# Altium project BreadBoard_project.PrjPcb (part 1 of 2)
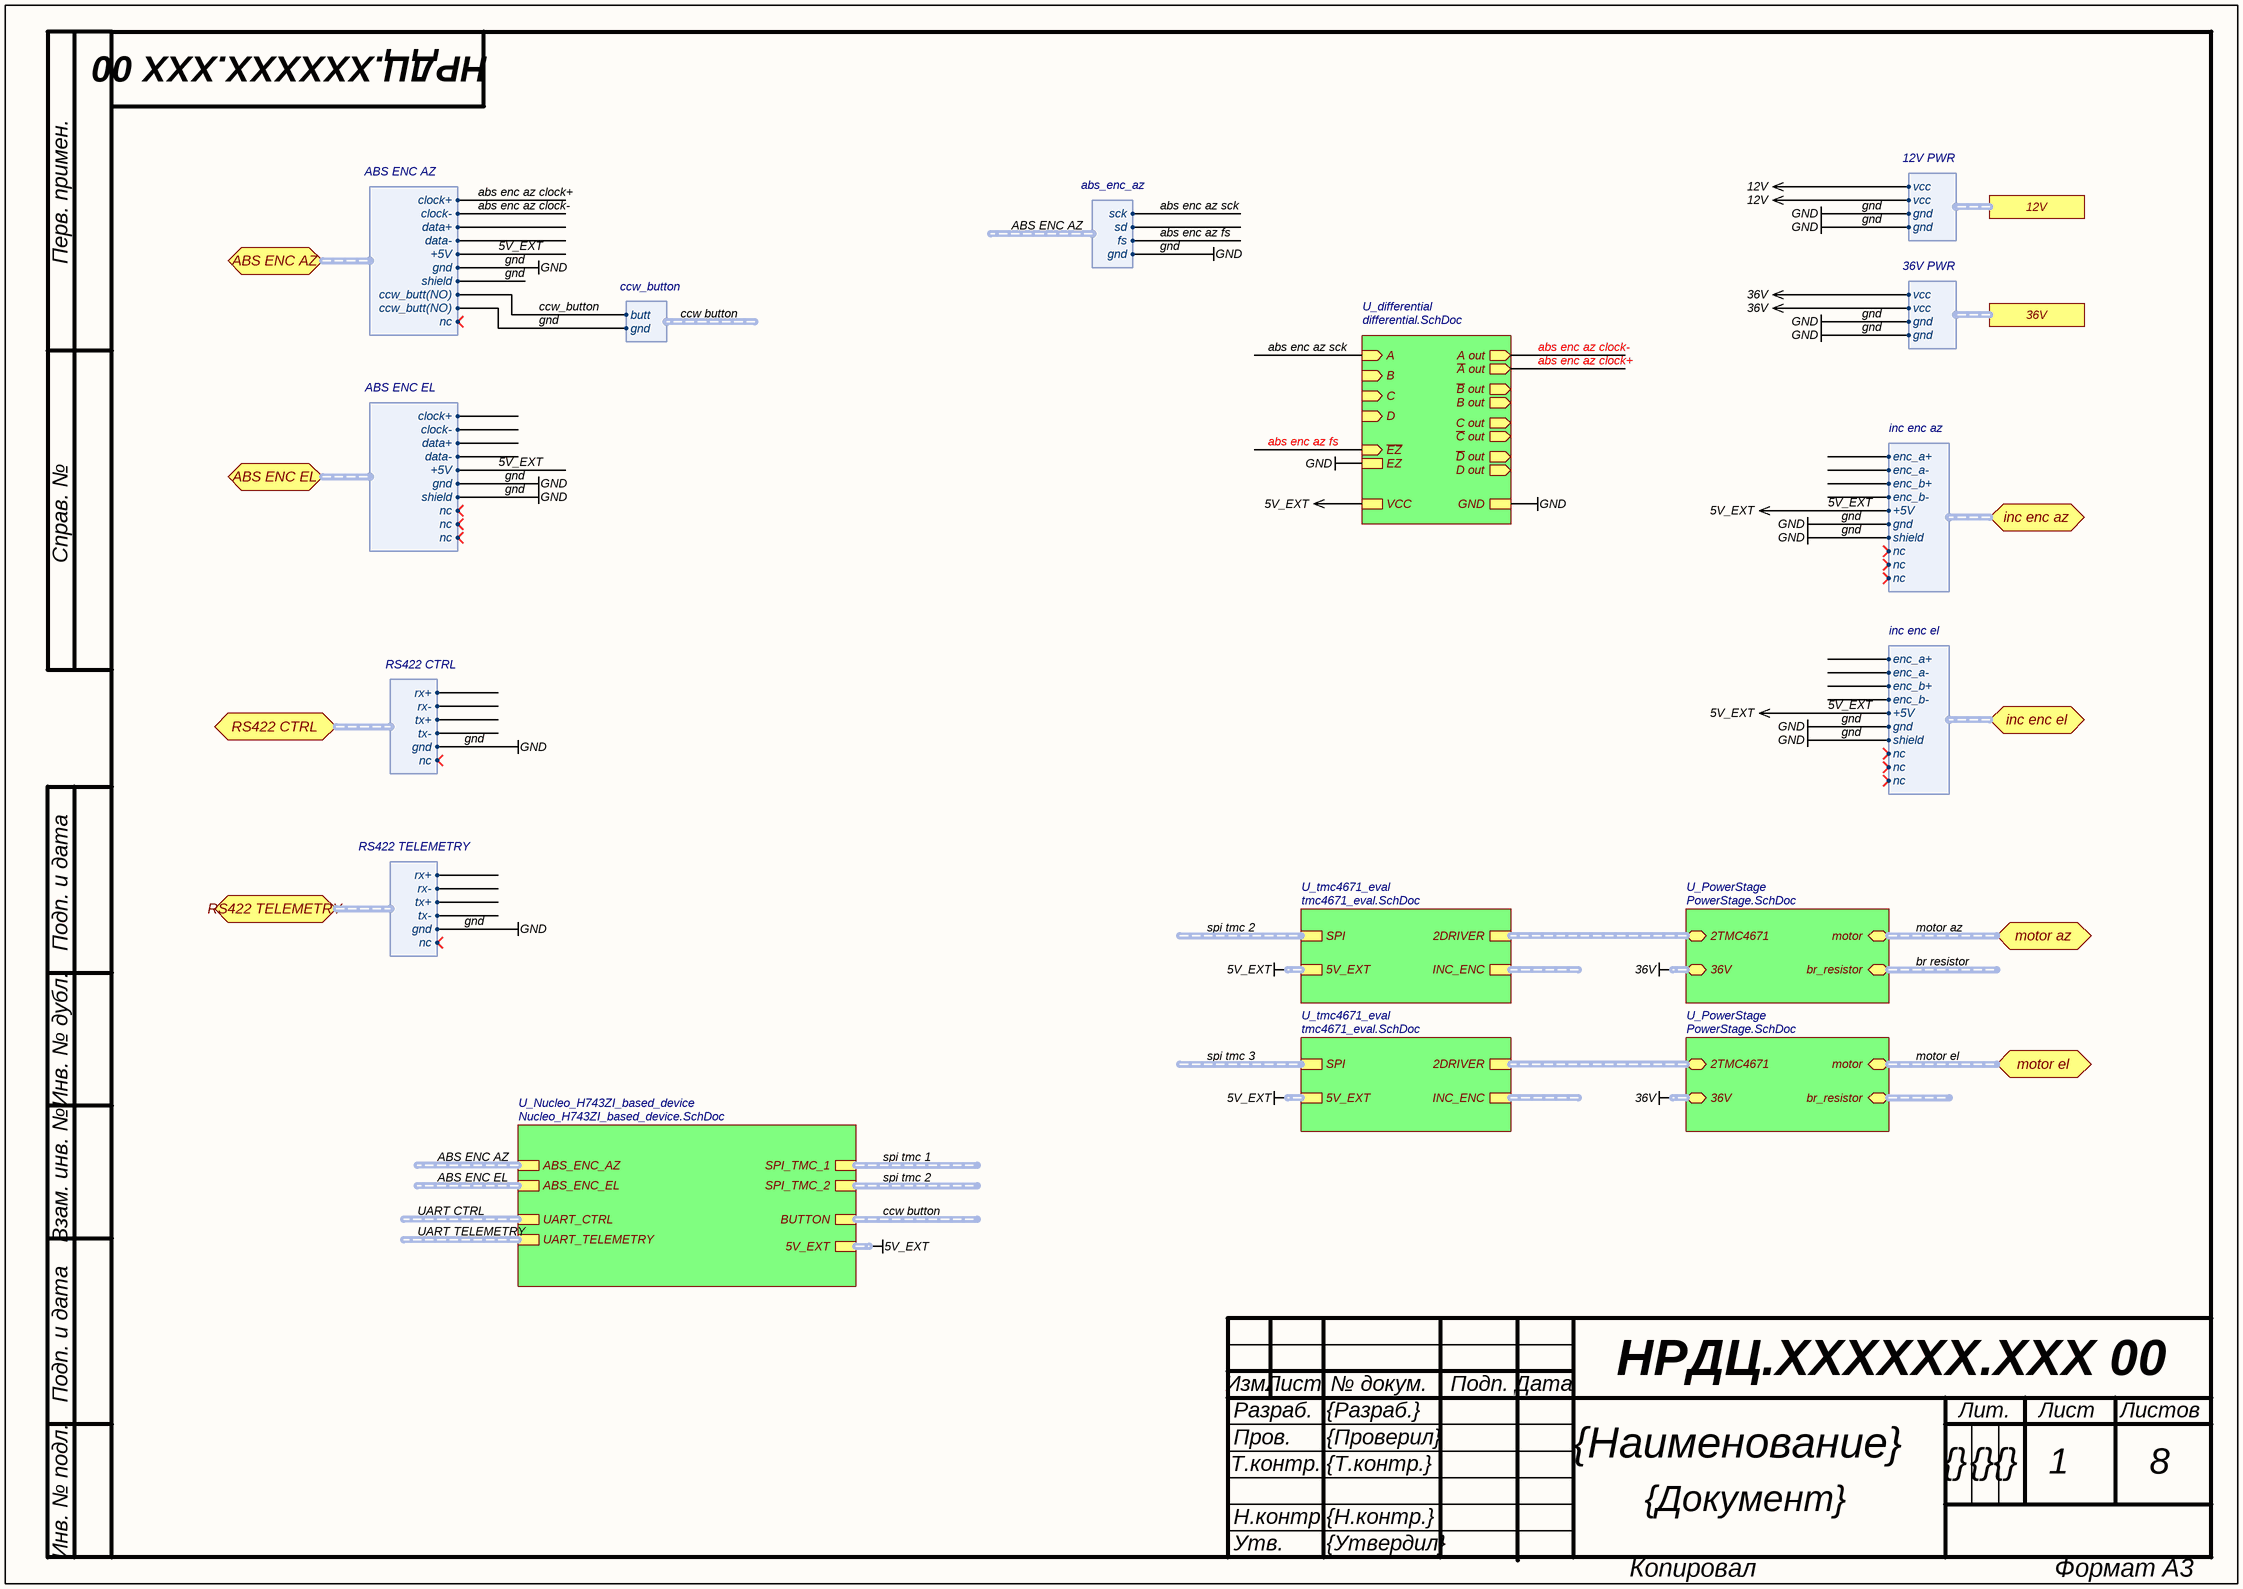
[diagram p0: Top.SchDoc]
8 sheets, 219 parts. Net scope: hierarchical (ports join the sheet entries above them; power ports are global).
Sheets:
  Top.SchDoc
    U_Nucleo_H743ZI_based_device = Nucleo_H743ZI_based_device.SchDoc
      U_Nucleo_H743ZI = Nucleo_H743ZI.SchDoc
    U_tmc4671_eval = tmc4671_eval.SchDoc
      U_tmc4671_InterfaceConnectors = tmc4671_InterfaceConnectors.SchDoc
      U_tmc4671_Output_Feedback = tmc4671_Output_Feedback.SchDoc
    U_tmc4671_eval = tmc4671_eval.SchDoc
      U_tmc4671_InterfaceConnectors = tmc4671_InterfaceConnectors.SchDoc
      U_tmc4671_Output_Feedback = tmc4671_Output_Feedback.SchDoc
    U_PowerStage = PowerStage.SchDoc
    U_PowerStage = PowerStage.SchDoc
    U_differential = differential.SchDoc

## Sheet Top.SchDoc: {Наименование}
size 420 x 297 mm; ApprovedBy: {Утвердил}; CheckedBy: {Проверил}; DrawnBy: {Разраб.}; DocumentNumber: НРДЦ.ХХХХХХ.ХХХ 00; SheetNumber: 1; SheetTotal: 8; Scale: {Мш.}; PageSetup: Record=PageOptions|CenterHorizontal=False|CenterVertical=False|PrintScale=0.95|XCorrection=0.00|YCorrection=0.00|PrintKind=1|BorderSize=5000000|LeftOffset=0|BottomOffset=0|Orientation=1|PaperLength=1000|PaperWidth=1000|Scale=100|PaperSource=15|PrintQuality=600|MediaType=1|DitherType=10|PaperKind=A4|PrintScaleMode=1; ProcessInspection: {Т.контр.}; Mass: {М.}; NormInspection: {Н.контр.}; Letter1Column: {}; Letter2Column: {}; Letter3Column: {}; DocumentType: {Документ}; Rule: PcbType=ProtelPcb

### Sub-sheets
U_differential = differential.SchDoc: A (in), A out (out), ~{A} out (out), ~{EZ} (in), ~{B} out (out), B out (out), B (in), GND, C (in), C out (out), ~{C} out (out), ~{D} out (out), D out (out), D (in), VCC, EZ
U_Nucleo_H743ZI_based_device = Nucleo_H743ZI_based_device.SchDoc: ABS_ENC_AZ (harness abs_enc_az), SPI_TMC_1 (harness spi_tmc_1), SPI_TMC_2 (harness spi_tmc_2), ABS_ENC_EL (harness abs_enc_el), UART_TELEMETRY (harness uart_telemetry), UART_CTRL (harness uart_ctrl), BUTTON (harness ccw_button), 5V_EXT (harness 5V_ext)
U_PowerStage = PowerStage.SchDoc: motor (bidir), br_resistor (bidir), 2TMC4671 (bidir), 36V (bidir)
U_PowerStage = PowerStage.SchDoc: motor (bidir), br_resistor (bidir), 2TMC4671 (bidir), 36V (bidir)
U_tmc4671_eval = tmc4671_eval.SchDoc: SPI (harness tmc_spi), 5V_EXT (harness 5V_tmc), 2DRIVER (harness tmc_spi), INC_ENC (harness tmc_inc_enc)
U_tmc4671_eval = tmc4671_eval.SchDoc: SPI (harness tmc_spi), 5V_EXT (harness 5V_tmc), 2DRIVER (harness tmc_spi), INC_ENC (harness tmc_inc_enc)

### Ports
12V (harness 12V PWR), 36V (harness 36V PWR), ABS ENC AZ (bidir, harness ABS ENC AZ), ABS ENC EL (bidir, harness ABS ENC EL), inc enc az (bidir, harness inc enc az), inc enc el (bidir, harness inc enc el), motor az (bidir), motor el (bidir), RS422 CTRL (bidir, harness RS422 CTRL), RS422 TELEMETRY (bidir, harness RS422 TELEMETRY)

### Harnesses
inc enc az: enc_a+, enc_a-, enc_b+, enc_b-, +5V, gnd, shield, nc, nc, nc
inc enc el: enc_a+, enc_a-, enc_b+, enc_b-, +5V, gnd, shield, nc, nc, nc
ABS ENC AZ: clock+, clock-, data+, data-, +5V, gnd, shield, ccw_butt(NO), ccw_butt(NO), nc
ABS ENC EL: clock+, clock-, data+, data-, +5V, gnd, shield, nc, nc, nc
ccw_button: butt, gnd
RS422 CTRL: rx+, rx-, tx+, tx-, gnd, nc
RS422 TELEMETRY: rx+, rx-, tx+, tx-, gnd, nc
12V PWR: vcc, gnd, vcc, gnd
36V PWR: vcc, gnd, vcc, gnd
abs_enc_az: sck, sd, fs, gnd

### Nets
5V_EXT: sheet U_differential/VCC, port inc enc az.+5V, port inc enc el.+5V, port ABS ENC AZ.+5V, port ABS ENC EL.+5V
12V: port 12V.vcc
36V: port 36V.vcc
abs enc az fs: sheet U_differential/~{EZ}, sheet U_Nucleo_H743ZI_based_device/ABS_ENC_AZ.fs
abs enc az sck: sheet U_differential/A, sheet U_Nucleo_H743ZI_based_device/ABS_ENC_AZ.sck
ccw_button: sheet U_differential/GND, sheet U_differential/EZ, port inc enc az.gnd, port inc enc az.shield, port inc enc el.gnd, port inc enc el.shield, port ABS ENC AZ.gnd, port ABS ENC AZ.shield, port ABS ENC AZ.ccw_butt(NO), port ABS ENC EL.gnd, port ABS ENC EL.shield, sheet U_Nucleo_H743ZI_based_device/BUTTON.butt, sheet U_Nucleo_H743ZI_based_device/BUTTON.gnd, port RS422 CTRL.gnd, port RS422 TELEMETRY.gnd, port 12V.gnd, port 36V.gnd, sheet U_Nucleo_H743ZI_based_device/ABS_ENC_AZ.gnd  [also labelled GND]  [project net ABS ENC AZ.gnd]
abs enc az clock+: sheet U_differential/~{A} out, port ABS ENC AZ.clock+
abs enc az clock-: sheet U_differential/A out, port ABS ENC AZ.clock-

### Buses and harness runs
harness ABS ENC AZ = sheet U_Nucleo_H743ZI_based_device/ABS_ENC_AZ
harness ABS ENC EL = sheet U_Nucleo_H743ZI_based_device/ABS_ENC_EL
harness br resistor = sheet U_PowerStage/br_resistor
harness ccw button = sheet U_Nucleo_H743ZI_based_device/BUTTON
harness motor az = port motor az = sheet U_PowerStage/motor
harness motor el = port motor el = sheet U_PowerStage/motor
harness sheet U_PowerStage/2TMC4671 = sheet U_tmc4671_eval/2DRIVER
harness spi tmc 1 = sheet U_Nucleo_H743ZI_based_device/SPI_TMC_1
harness spi tmc 2 = sheet U_Nucleo_H743ZI_based_device/SPI_TMC_2
harness spi tmc 2 = sheet U_tmc4671_eval/SPI
harness spi tmc 3 = sheet U_tmc4671_eval/SPI
harness UART CTRL = sheet U_Nucleo_H743ZI_based_device/UART_CTRL
harness UART TELEMETRY = sheet U_Nucleo_H743ZI_based_device/UART_TELEMETRY

### Notes on the sheet
- Labels drawn without touching a wire or pin: 5V_EXT, 36V
- Перв. примен.
- Справ. №
- Подп. и дата
- Инв. № дубл.
- Взам. инв. №
- Изм.
- Лист
- № докум.
- Подп.
- Дата
- Т.контр.
- Пров.
- Разраб.
- Лит.
- Листов
- Инв. № подл.
- Н.контр.
- Утв.
- Копировал
- Формат А3

## Sheet Nucleo_H743ZI_based_device.SchDoc: {Наименование}
size 420 x 297 mm; DocumentNumber: НРДЦ.ХХХХХХ.ХХХ ХХ; SheetNumber: 2; SheetTotal: 8; PageSetup: Record=PageOptions|CenterHorizontal=False|CenterVertical=False|PrintScale=0.95|XCorrection=0.00|YCorrection=0.00|PrintKind=1|BorderSize=5000000|LeftOffset=0|BottomOffset=0|Orientation=1|PaperLength=1000|PaperWidth=1000|Scale=100|PaperSource=15|PrintQuality=600|MediaType=1|DitherType=10|PaperKind=A4|PrintScaleMode=1; Rule: PcbType=ProtelPcb
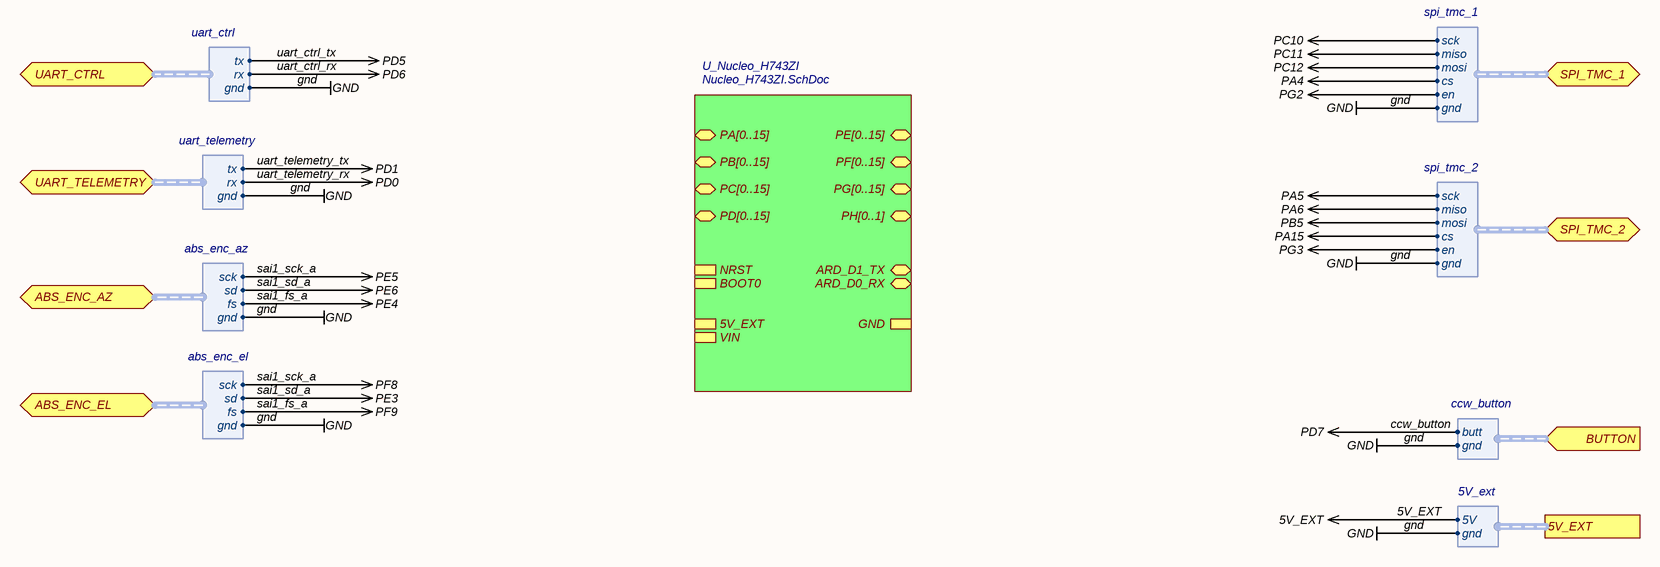
[diagram p1: Nucleo_H743ZI_based_device.SchDoc]

### Sub-sheets
U_Nucleo_H743ZI = Nucleo_H743ZI.SchDoc: PF[0..15] (bidir), PG[0..15] (bidir), PE[0..15] (bidir), PD[0..15] (bidir), ARD_D1_TX (bidir), PH[0..1] (bidir), PA[0..15] (bidir), ARD_D0_RX (bidir), BOOT0, PB[0..15] (bidir), PC[0..15] (bidir), NRST, 5V_EXT, VIN, GND

### Ports
5V_EXT (harness 5V_ext), ABS_ENC_AZ (bidir, harness abs_enc_az), ABS_ENC_EL (bidir, harness abs_enc_el), BUTTON (in, harness ccw_button), SPI_TMC_1 (bidir, harness spi_tmc_1), SPI_TMC_2 (bidir, harness spi_tmc_2), UART_CTRL (bidir, harness uart_ctrl), UART_TELEMETRY (bidir, harness uart_telemetry)

### Harnesses
abs_enc_az: sck, sd, fs, gnd
uart_ctrl: tx, rx, gnd
uart_telemetry: tx, rx, gnd
abs_enc_el: sck, sd, fs, gnd
ccw_button: butt, gnd
5V_ext: 5V, gnd
spi_tmc_1: sck, miso, gnd, mosi, en, cs
spi_tmc_2: sck, miso, gnd, mosi, en, cs

### Nets
5V_EXT: sheet U_Nucleo_H743ZI/5V_EXT, port 5V_EXT.5V
ccw_button: sheet U_Nucleo_H743ZI/GND, port ABS_ENC_AZ.gnd, port UART_CTRL.gnd, port UART_TELEMETRY.gnd, port ABS_ENC_EL.gnd, port BUTTON.butt, port BUTTON.gnd, port 5V_EXT.gnd, port SPI_TMC_1.gnd, port SPI_TMC_2.gnd  [also labelled GND, PD7]  [project net ABS ENC AZ.gnd]
PA4: port SPI_TMC_1.cs  [project net spi tmc 1.cs]
PC10: port SPI_TMC_1.sck  [project net spi tmc 1.sck]
PC11: port SPI_TMC_1.miso  [project net spi tmc 1.miso]
PC12: port SPI_TMC_1.mosi  [project net spi tmc 1.mosi]
PD0: port UART_TELEMETRY.rx  [also labelled uart_telemetry_rx]  [project net UART TELEMETRY.rx]
PD1: port UART_TELEMETRY.tx  [also labelled uart_telemetry_tx]  [project net UART TELEMETRY.tx]
PD5: port UART_CTRL.tx  [also labelled uart_ctrl_tx]  [project net UART CTRL.tx]
PD6: port UART_CTRL.rx  [also labelled uart_ctrl_rx]  [project net UART CTRL.rx]
PE3: port ABS_ENC_AZ.sd, port ABS_ENC_EL.sd  [also labelled PE6, sai1_sd_a]  [project net ABS ENC AZ.sd]
PE4: port ABS_ENC_AZ.fs, port ABS_ENC_EL.fs  [also labelled PF9, sai1_fs_a]  [project net abs enc az fs]
PE5: port ABS_ENC_AZ.sck, port ABS_ENC_EL.sck  [also labelled PF8, sai1_sck_a]  [project net abs enc az sck]
PG2: port SPI_TMC_1.en  [project net spi tmc 1.en]

### Notes on the sheet
- Подп. и дата
- Инв. № дубл.
- Взам. инв. №
- Инв. № подл.
- Лист
- Изм.
- № докум.
- Подп.
- Дата
- Копировал
- Формат А3

## Sheet Nucleo_H743ZI.SchDoc: {Наименование}
size 420 x 297 mm; DocumentNumber: НРДЦ.ХХХХХХ.ХХХ ХХ; SheetNumber: 3; SheetTotal: 3; PageSetup: Record=PageOptions|CenterHorizontal=False|CenterVertical=False|PrintScale=0.95|XCorrection=0.00|YCorrection=0.00|PrintKind=1|BorderSize=5000000|LeftOffset=0|BottomOffset=0|Orientation=1|PaperLength=1000|PaperWidth=1000|Scale=100|PaperSource=15|PrintQuality=600|MediaType=1|DitherType=10|PaperKind=A4|PrintScaleMode=1; Rule: PcbType=ProtelPcb
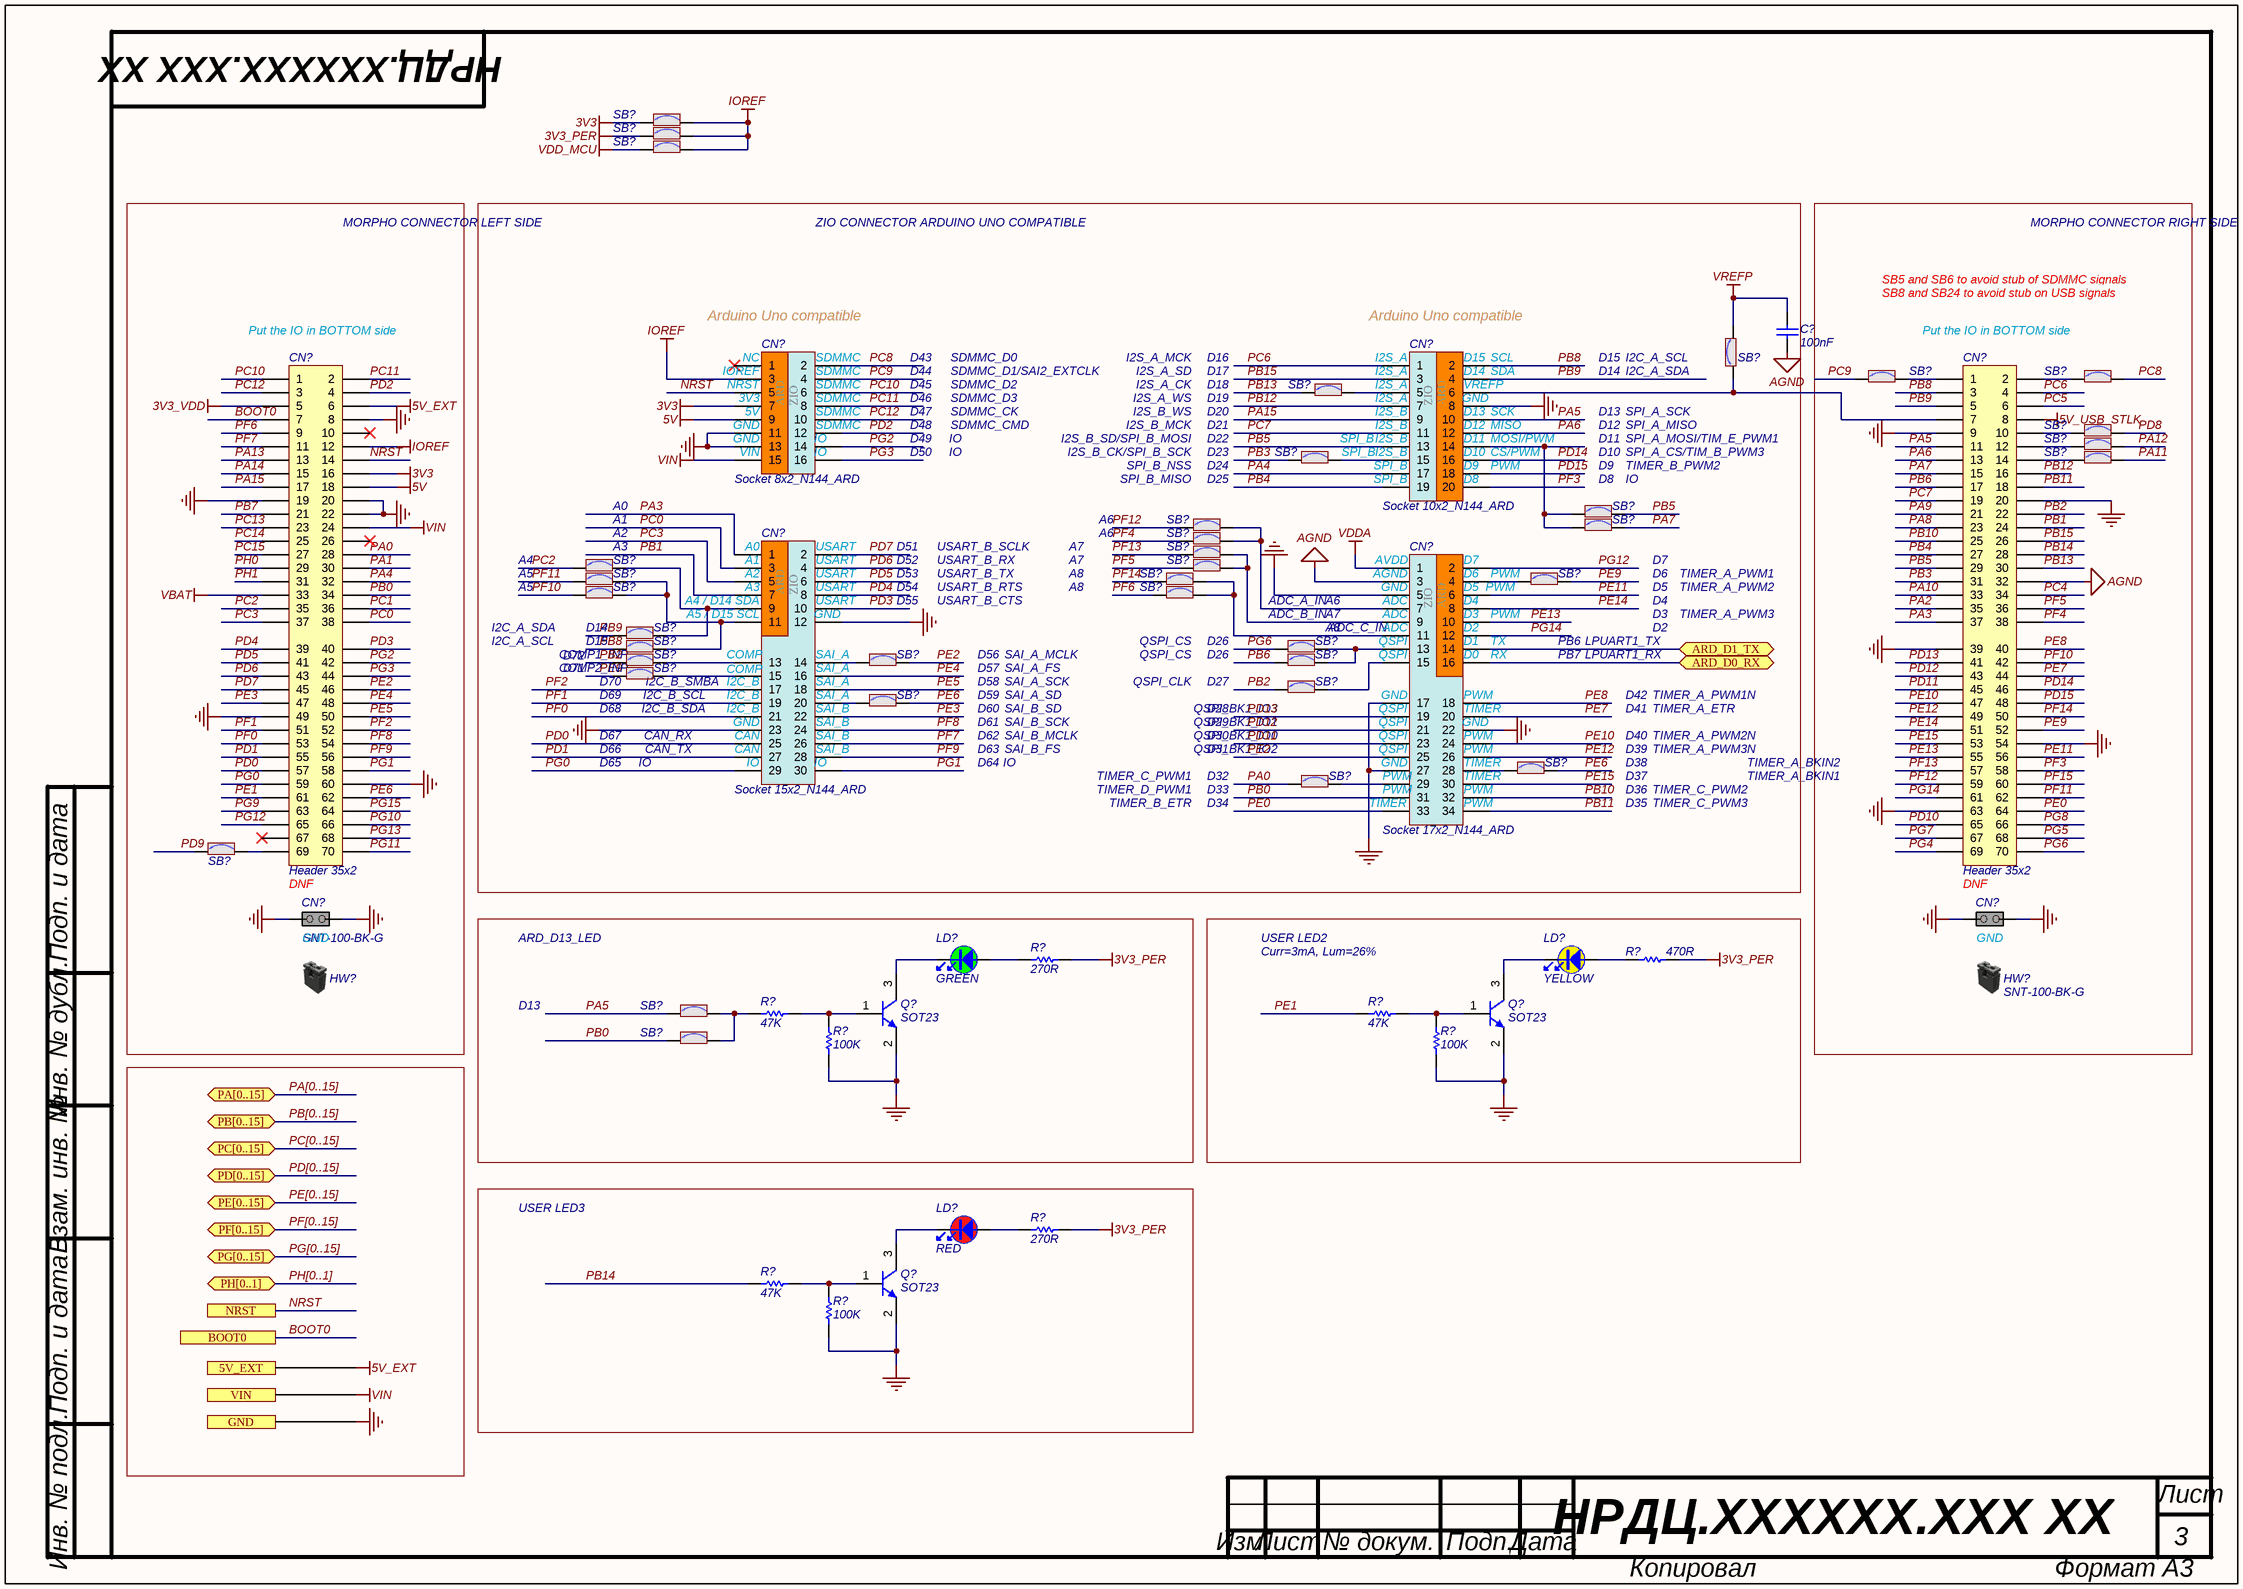
[diagram p2: Nucleo_H743ZI.SchDoc]

### Parts
(Parts that share a designator on the sheet are numbered #1, #2 ... from top to bottom, then left to right.)
C?  value 100nF  [C0603]  (hidden comment: Capacitor)
CN?#1  Socket 8x2_N144_ARD  [CON_SAMTEC_SSW-108-23-X-D_N144_ARD]
CN?#2  Socket 10x2_N144_ARD  [CON_SAMTEC_SSW-110-23-X-D_N144_ARD]
CN?#3  Header 35x2  [CON_SAMTEC_TSW-135-07-X-D]
CN?#4  Header 35x2  [CON_SAMTEC_TSW-135-07-X-D]
CN?#5  Socket 15x2_N144_ARD  [CON_SAMTEC_SSW-115-23-X-D_N144_ARD]
CN?#6  Socket 17x2_N144_ARD  [CON_SAMTEC_SSW-117-23-X-D_N144_ARD]
CN?#7  Jumper_Header 2x1  [CON_SAMTEC_TSW-102-09-X-S]  (value not drawn)
CN?#8  Jumper_Header 2x1  [CON_SAMTEC_TSW-102-09-X-S]  (value not drawn)
HW?#1  value SNT-100-BK-G  (hidden comment: Shunt Black 2.54mm)  (mechanical)
HW?#2  value SNT-100-BK-G  (hidden comment: Shunt Black 2.54mm)  (mechanical)
LD?#1  value GREEN  [LED_0603_OSRAM_LG-Q396-PS-35_GREEN_1A2K_H0P4]  (hidden comment: LED_green)
LD?#2  value YELLOW  [LED_0603_OSRAM_LY-Q396-P1Q2-36_YELLOW_1A2K_H0P4]  (hidden comment: LED_yellow)
LD?#3  value RED  [LED_0603_OSRAM_LS-Q976-NR-1_RED_1A2K_H0P8]  (hidden comment: LED_red)
Q?#1  value SOT23  [NPN_SOT23]  (hidden comment: 9013-SOT23)
Q?#2  value SOT23  [NPN_SOT23]  (hidden comment: 9013-SOT23)
Q?#3  value SOT23  [NPN_SOT23]  (hidden comment: 9013-SOT23)
R?#1  value 270R  [R0402]  (hidden comment: Resistor)
R?#2  value 470R  [R0402]  (hidden comment: Resistor)
R?#3  value 47K  [R0603]  (hidden comment: Resistor)
R?#4  value 47K  [R0603]  (hidden comment: Resistor)
R?#5  value 100K  [R0603]  (hidden comment: Resistor)
R?#6  value 100K  [R0603]  (hidden comment: Resistor)
R?#7  value 270R  [R0402]  (hidden comment: Resistor)
R?#8  value 47K  [R0603]  (hidden comment: Resistor)
R?#9  value 100K  [R0603]  (hidden comment: Resistor)
SB?#1  SB_ON  [SOLDER-BRIDGE_R0603-0R]  (value not drawn)
SB?#2  SB_ON  [SOLDER-BRIDGE_R0603-0R]  (value not drawn)
SB?#3  SB_ON  [SOLDER-BRIDGE_R0603-0R]  (value not drawn)
SB?#4  SB_ON  [SOLDER-BRIDGE_R0603-0R]  (value not drawn)
SB?#5  SB_ON  [SOLDER-BRIDGE_R0603-0R]  (value not drawn)
SB?#6  SB_ON  [SOLDER-BRIDGE_R0603-0R]  (value not drawn)
SB?#7  SB_ON  [SOLDER-BRIDGE_R0603-0R]  (value not drawn)
SB?#8  SB_ON  [SOLDER-BRIDGE_R0402-0R]  (value not drawn)
SB?#9  SB_ON  [SOLDER-BRIDGE_R0603-0R]  (value not drawn)
SB?#10  SB_ON  [SOLDER-BRIDGE_R0603-0R]  (value not drawn)
SB?#11  SB_ON  [SOLDER-BRIDGE_R0603-0R]  (value not drawn)
SB?#12  SB_ON  [SOLDER-BRIDGE_R0603-0R]  (value not drawn)
SB?#13  SB_ON  [SOLDER-BRIDGE_R0402-0R]  (value not drawn)
SB?#14  SB_ON  [SOLDER-BRIDGE_R0603-0R]  (value not drawn)
SB?#15  SB_ON  [SOLDER-BRIDGE_R0402-0R]  (value not drawn)
SB?#16  SB_ON  [SOLDER-BRIDGE_R0402-0R]  (value not drawn)
SB?#17  SB_ON  [SOLDER-BRIDGE_R0402-0R]  (value not drawn)
SB?#18  SB_ON  [SOLDER-BRIDGE_R0402-0R]  (value not drawn)
SB?#19  SB_ON  [SOLDER-BRIDGE_R0402-0R]  (value not drawn)
SB?#20  SB_ON  [SOLDER-BRIDGE_R0402-0R]  (value not drawn)
SB?#21  SB_ON  [SOLDER-BRIDGE_R0402-0R]  (value not drawn)
SB?#22  SB_ON  [SOLDER-BRIDGE_R0402-0R]  (value not drawn)
SB?#23  SB_ON  [SOLDER-BRIDGE_R0402-0R]  (value not drawn)
SB?#24  SB_ON  [SOLDER-BRIDGE_R0402-0R]  (value not drawn)
SB?#25  SB_ON  [SOLDER-BRIDGE_R0402-0R]  (value not drawn)
SB?#26  SB_ON  [SOLDER-BRIDGE_R0402-0R]  (value not drawn)
SB?#27  SB_ON  [SOLDER-BRIDGE_R0402-0R]  (value not drawn)
SB?#28  SB_ON  [SOLDER-BRIDGE_R0402-0R]  (value not drawn)
SB?#29  SB_ON  [SOLDER-BRIDGE_R0402-0R]  (value not drawn)
SB?#30  SB_ON  [SOLDER-BRIDGE_R0402-0R]  (value not drawn)
SB?#31  SB_ON  [SOLDER-BRIDGE_R0402-0R]  (value not drawn)
SB?#32  SB_ON  [SOLDER-BRIDGE_R0402-0R]  (value not drawn)
SB?#33  SB_ON  [SOLDER-BRIDGE_R0402-0R]  (value not drawn)
SB?#34  SB_ON  [SOLDER-BRIDGE_R0402-0R]  (value not drawn)
SB?#35  SB_ON  [SOLDER-BRIDGE_R0402-0R]  (value not drawn)
SB?#36  SB_ON  [SOLDER-BRIDGE_R0603-0R]  (value not drawn)
SB?#37  SB_ON  [SOLDER-BRIDGE_R0603-0R]  (value not drawn)

### Blocks framed on the sheet
USER LED3: LD?#3 Q?#3 R?#7-R?#9

### Ports
5V_EXT, ARD_D0_RX (bidir), ARD_D1_TX (bidir), BOOT0, GND, NRST, PA[0..15] (bidir), PB[0..15] (bidir), PC[0..15] (bidir), PD[0..15] (bidir), PE[0..15] (bidir), PF[0..15] (bidir), PG[0..15] (bidir), PH[0..1] (bidir), VIN

### Nets
3V3: CN?#1.7 CN?#3.16 SB?#1.1
3V3_PER: R?#1.2 R?#2.2 R?#7.2 SB?#2.1
3V3_VDD: CN?#3.5
5V: CN?#1.9 CN?#3.18
5V_EXT: CN?#3.6 ; port 5V_EXT
5V_USB_STLK: CN?#4.8
AGND: C?.1 CN?#4.32 CN?#6.3
GND: CN?#1.11 CN?#1.13 CN?#2.8 CN?#3.8 CN?#3.19 CN?#3.20 CN?#3.22 CN?#3.49 CN?#3.60 CN?#4.9 CN?#4.20 CN?#4.39 CN?#4.54 CN?#4.63 CN?#5.12 CN?#5.23 CN?#6.5 CN?#6.17 CN?#6.22 CN?#6.27 CN?#7.1(COMMON) CN?#7.2(NO) CN?#8.1(COMMON) CN?#8.2(NO) Q?#1.2(E) Q?#2.2(E) Q?#3.2(E) R?#5.1 R?#6.1 R?#9.1 ; port GND  [project net ABS ENC AZ.gnd]
IOREF: CN?#1.3 CN?#3.12 SB?#1.2 SB?#2.2 SB?#3.2
VBAT: CN?#3.33
VDD_MCU: SB?#3.1
VDDA: CN?#6.1
VIN: CN?#1.15 CN?#3.24 ; port VIN
VREFP: C?.2 SB?#4.2
BOOT0: CN?#3.7 ; port BOOT0
NRST: CN?#1.5 CN?#3.14 ; port NRST
PA0: CN?#3.28 SB?#34.1
PA1: CN?#3.30
PA2: CN?#4.35
PA3: CN?#4.37 CN?#5.1
PA4: CN?#2.17 CN?#3.32
PA5: CN?#2.10 CN?#4.11 SB?#36.1
PA6: CN?#2.12 CN?#4.13
PA7: CN?#4.15 SB?#14.2
PA8: CN?#4.23
PA9: CN?#4.21
PA10: CN?#4.33
PA11: SB?#11.2
PA12: SB?#9.2
PA13: CN?#3.13
PA14: CN?#3.15
PA15: CN?#2.9 CN?#3.17
PB0: CN?#3.34 CN?#6.31 SB?#37.1
PB1: CN?#4.24 CN?#5.7
PB2: CN?#4.22 SB?#27.1 SB?#31.1
PB3: CN?#4.31 SB?#10.1
PB4: CN?#2.19 CN?#4.27
PB5: CN?#2.13 CN?#4.29 SB?#12.2
PB6: CN?#4.17 SB?#29.1
PB7: CN?#3.21
PB8: CN?#2.2 CN?#4.3 SB?#25.1
PB9: CN?#2.4 CN?#4.5 SB?#24.1
PB10: CN?#4.25 CN?#6.32
PB11: CN?#4.18 CN?#6.34
PB12: CN?#2.7 CN?#4.16
PB13: CN?#4.30 SB?#7.1
PB14: CN?#4.28 R?#8.1
PB15: CN?#2.3 CN?#4.26
PC0: CN?#3.38 CN?#5.3
PC1: CN?#3.36
PC2: CN?#3.35 SB?#17.1
PC3: CN?#3.37 CN?#5.5
PC4: CN?#4.34
PC5: CN?#4.6
PC6: CN?#2.1 CN?#4.4
PC7: CN?#2.11 CN?#4.19
PC8: CN?#1.2 SB?#6.2
PC9: CN?#1.4 SB?#5.1
PC10: CN?#1.6 CN?#3.1
PC11: CN?#1.8 CN?#3.2
PC12: CN?#1.10 CN?#3.3
PC13: CN?#3.23
PC14: CN?#3.25
PC15: CN?#3.27
PD0: CN?#3.57 CN?#5.25
PD1: CN?#3.55 CN?#5.27
PD2: CN?#1.12 CN?#3.4
PD3: CN?#3.40 CN?#5.10
PD4: CN?#3.39 CN?#5.8
PD5: CN?#3.41 CN?#5.6
PD6: CN?#3.43 CN?#5.4
PD7: CN?#3.45 CN?#5.2
PD8: SB?#8.2
PD9: SB?#35.1
PD10: CN?#4.65
PD11: CN?#4.45 CN?#6.23
PD12: CN?#4.43 CN?#6.21
PD13: CN?#4.41 CN?#6.19
PD14: CN?#2.16 CN?#4.46
PD15: CN?#2.18 CN?#4.48
PE0: CN?#4.64 CN?#6.33
PE1: CN?#3.61 R?#4.1
PE2: CN?#3.46 CN?#6.25 SB?#28.2
PE3: CN?#3.47 CN?#5.22
PE4: CN?#3.48 CN?#5.16
PE5: CN?#3.50 CN?#5.18
PE6: CN?#3.62 SB?#32.2 SB?#33.2
PE7: CN?#4.44 CN?#6.20
PE8: CN?#4.40 CN?#6.18
PE9: CN?#4.52 SB?#21.2 SB?#30.1
PE10: CN?#4.47 CN?#6.24
PE11: CN?#4.56 CN?#6.6
PE12: CN?#4.49 CN?#6.26
PE13: CN?#4.55 CN?#6.10
PE14: CN?#4.51 CN?#6.8
PE15: CN?#4.53 CN?#6.30
PF0: CN?#3.53 CN?#5.21
PF1: CN?#3.51 CN?#5.19
PF2: CN?#3.52 CN?#5.17
PF3: CN?#2.20 CN?#4.58
PF4: CN?#4.38 SB?#15.1
PF5: CN?#4.36 SB?#18.1
PF6: CN?#3.9 SB?#23.1
PF7: CN?#3.11 CN?#5.26
PF8: CN?#3.54 CN?#5.24
PF9: CN?#3.56 CN?#5.28
PF10: CN?#4.42 SB?#22.1
PF11: CN?#4.62 SB?#19.1
PF12: CN?#4.59 SB?#13.1
PF13: CN?#4.57 SB?#16.1
PF14: CN?#4.50 SB?#20.1
PF15: CN?#4.60
PG0: CN?#3.59 CN?#5.29
PG1: CN?#3.58 CN?#5.30
PG2: CN?#1.14 CN?#3.42
PG3: CN?#1.16 CN?#3.44
PG4: CN?#4.69
PG5: CN?#4.68
PG6: CN?#4.70 SB?#26.1
PG7: CN?#4.67
PG8: CN?#4.66
PG9: CN?#3.63
PG10: CN?#3.66
PG11: CN?#3.70
PG12: CN?#3.65 CN?#6.2
PG13: CN?#3.68
PG14: CN?#4.61 CN?#6.12
PG15: CN?#3.64
PH0: CN?#3.29
PH1: CN?#3.31
NetCN?#2_5: CN?#2.5 SB?#7.2
NetCN?#2_6: CN?#2.6 CN?#4.7 SB?#4.1
NetCN?#2_14: CN?#2.14 SB?#12.1 SB?#14.1
NetCN?#2_15: CN?#2.15 SB?#10.2
NetCN?#3_69: CN?#3.69 SB?#35.2
NetCN?#4_1: CN?#4.1 SB?#5.2
NetCN?#4_2: CN?#4.2 SB?#6.1
NetCN?#4_10: CN?#4.10 SB?#8.1
NetCN?#4_12: CN?#4.12 SB?#9.1
NetCN?#4_14: CN?#4.14 SB?#11.1
NetCN?#5_9: CN?#5.9 SB?#17.2 SB?#24.2
NetCN?#5_11: CN?#5.11 SB?#19.2 SB?#22.2 SB?#25.2
NetCN?#5_13: CN?#5.13 SB?#27.2
NetCN?#5_14: CN?#5.14 SB?#28.1
NetCN?#5_15: CN?#5.15 SB?#30.2
NetCN?#5_20: CN?#5.20 SB?#32.1
NetCN?#6_4: CN?#6.4 SB?#21.1
NetCN?#6_7: CN?#6.7 SB?#13.2 SB?#15.2
NetCN?#6_9: CN?#6.9 SB?#16.2 SB?#18.2
NetCN?#6_11: CN?#6.11 SB?#20.2 SB?#23.2
NetCN?#6_13: CN?#6.13 SB?#26.2 SB?#29.2
NetCN?#6_14: CN?#6.14 ; port ARD_D1_TX
NetCN?#6_15: CN?#6.15 SB?#31.2
NetCN?#6_16: CN?#6.16 ; port ARD_D0_RX
NetCN?#6_28: CN?#6.28 SB?#33.1
NetCN?#6_29: CN?#6.29 SB?#34.2
NetLD?#1_1: LD?#1.1 R?#1.1
NetLD?#1_2: LD?#1.2 Q?#1.3(C)
NetLD?#2_1: LD?#2.1 R?#2.1
NetLD?#2_2: LD?#2.2 Q?#2.3(C)
NetLD?#3_1: LD?#3.1 R?#7.1
NetLD?#3_2: LD?#3.2 Q?#3.3(C)
NetQ?#1_1: Q?#1.1(B) R?#3.2 R?#5.2
NetQ?#2_1: Q?#2.1(B) R?#4.2 R?#6.2
NetQ?#3_1: Q?#3.1(B) R?#8.2 R?#9.2
NetR?#3_1: R?#3.1 SB?#36.2 SB?#37.2

Not connected (* = marked no-connect by the designer): CN?#1 1*; CN?#3 10* 26* 67*

### Buses and harness runs
bus PA[0..15] = port PA[0..15]
bus PB[0..15] = port PB[0..15]
bus PC[0..15] = port PC[0..15]
bus PD[0..15] = port PD[0..15]
bus PE[0..15] = port PE[0..15]
bus PF[0..15] = port PF[0..15]
bus PG[0..15] = port PG[0..15]
bus PH[0..1] = port PH[0..1]

### Notes on the sheet
- MORPHO CONNECTOR LEFT SIDE
- ZIO CONNECTOR ARDUINO UNO COMPATIBLE
- MORPHO CONNECTOR RIGHT SIDE
- (near CN?#1) Arduino Uno compatible
- (near CN?#2) Arduino Uno compatible
- SB5 and SB6 to avoid stub of SDMMC signals
- SB8 and SB24 to avoid stub on USB signals
- (near CN?#3) Put the IO in BOTTOM side
- (near CN?#1) NC
- (near CN?#1) IOREF
- (near CN?#1) NRST
- (near CN?#1) SDMMC
- D43
- D44
- D45
- SDMMC_D0
- SDMMC_D1/SAI2_EXTCLK
- SDMMC_D2
- I2S_A_SD
- I2S_A_CK
- I2S_A_MCK
- D16
- D17
- D18
- (near CN?#2) I2S_A
- (near CN?#2) VREFP
- (near CN?#2) D14
- (near CN?#2) D15
- (near CN?#2) SCL
- (near CN?#2) SDA
- D15
- D14
- (near SB?#4) I2C_A_SCL
- (near SB?#4) I2C_A_SDA
- Put the IO in BOTTOM side
- (near CN?#1) 3V3
- (near CN?#1) 5V
- (near CN?#1) GND
- (near CN?#1) VIN
- (near CN?#1) IO
- D46
- D47
- D48
- D49
- D50
- SDMMC_CK
- SDMMC_CMD
- SDMMC_D3
- IO
- I2S_A_WS
- I2S_B_SD/SPI_B_MOSI
- I2S_B_CK/SPI_B_SCK
- I2S_B_WS
- I2S_B_MCK
- D19
- D20
- D21
- D22
- D23
- SPI_B
- (near SB?#10) SPI_B
- (near CN?#2) I2S_B
- (near CN?#2) D10
- (near CN?#2) D11
- (near CN?#2) D12
- (near CN?#2) D13
- (near CN?#2) SCK
- (near CN?#2) GND
- (near CN?#2) MISO
- (near CN?#2) MOSI/PWM
- (near CN?#2) CS/PWM
- D13
- D12
- D11
- D10
- SPI_A_CS/TIM_B_PWM3
- SPI_A_MOSI/TIM_E_PWM1
- SPI_A_SCK
- SPI_A_MISO
- A0
- (near SB?#17) A1
- A6
- (near SB?#13) SPI_B_MISO
- SPI_B_NSS
- D24
- (near SB?#13) D25
- (near CN?#2) SPI_B
- (near CN?#2) D8
- (near CN?#2) D9
- (near CN?#2) PWM
- (near SB?#12) D9
- (near SB?#12) D8
- (near SB?#12) TIMER_B_PWM2
- (near SB?#12) IO
- A4
- A5
- (near SB?#17) A2
- (near SB?#17) A3
- (near CN?#5) A0
- (near CN?#5) A1
- (near CN?#5) A2
- (near CN?#5) A3
- (near CN?#5) USART
- D51
- D52
- D53
- D54
- USART_B_TX
- USART_B_RX
- USART_B_SCLK
- USART_B_RTS
- A7
- A8
- (near CN?#6) GND
- (near CN?#6) AVDD
- (near CN?#6) AGND
- (near CN?#6) D7
- (near CN?#6) D6
- (near CN?#6) D5
- PWM
- D5
- D6
- (near SB?#14) D7
- TIMER_A_PWM1
- TIMER_A_PWM2
- I2C_A_SCL
- (near SB?#22) I2C_A_SDA
- COMP1_INP
- (near SB?#27) D72
- (near SB?#22) D14
- (near SB?#24) D15
- (near CN?#5) COMP
- (near CN?#5) A4 / D14 SDA
- (near CN?#5) A5 / D15 SCL
- (near CN?#5) SAI_A
- (near CN?#5) GND
- D55
- USART_B_CTS
- D56
- SAI_A_MCLK
- (near SB?#23) QSPI_CS
- QSPI_CS
- (near SB?#23) D26
- D26
- (near SB?#26) ADC_A_IN
- (near SB?#26) ADC_B_IN
- (near SB?#26) ADC_C_IN
- (near SB?#26) A7
- (near SB?#26) A8
- (near CN?#6) ADC
- (near CN?#6) QSPI
- (near CN?#6) D2
- (near CN?#6) D4
- (near CN?#6) D3
- (near CN?#6) D1
- (near CN?#6) D0
- (near CN?#6) TX
- (near CN?#6) RX
- PB6
- PB7
- LPUART1_TX
- LPUART1_RX
- D4
- D3
- D2
- TIMER_A_PWM3
- COMP2_INP
- (near SB?#30) D71
- (near SB?#30) D70
- (near SB?#30) D69
- (near SB?#30) D68
- (near SB?#30) I2C_B_SCL
- (near SB?#30) I2C_B_SDA
- (near SB?#30) I2C_B_SMBA
- (near CN?#5) I2C_B
- (near CN?#5) SAI_B
- D57
- D58
- D59
- D60
- D61
- SAI_A_SD
- SAI_A_SCK
- SAI_A_FS
- SAI_B_SD
- SAI_B_SCK
- QSPI_CLK
- QSPI_BK1_IO1
- QSPI_BK1_IO3
- D27
- D28
- D29
- (near CN?#6) TIMER
- (near CN?#6) PWM
- D41
- D42
- TIMER_A_PWM1N
- TIMER_A_ETR
- D67
- D66
- D65
- CAN_TX
- CAN_RX
- (near CN?#5) CAN
- (near CN?#5) IO
- D62
- D63
- D64
- SAI_B_FS
- SAI_B_MCLK
- TIMER_D_PWM1
- TIMER_C_PWM1
- QSPI_BK1_IO0
- QSPI_BK1_IO2
- D30
- D31
- D32
- D33
- D36
- D37
- D38
- D39
- D40
- TIMER_A_PWM2N
- TIMER_A_PWM3N
- TIMER_C_PWM2
- TIMER_A_BKIN1
- TIMER_A_BKIN2
- TIMER_B_ETR
- D34
- D35
- TIMER_C_PWM3
- (near CN?#3) DNF
- (near CN?#4) DNF
- GND
- ARD_D13_LED
- USER LED2
- Curr=3mA, Lum=26%
- Подп. и дата
- Инв. № дубл.
- Взам. инв. №
- Инв. № подл.
- Лист
- Изм.
- № докум.
- Подп.
- Дата
- Копировал
- Формат А3
- (in symbol MCD-01037) ARD; ZIO
- (in symbol MCD-01039) ZIO; ARD
- (in symbol MCD-01040) ARD; ZIO
- (in symbol MCD-01041) ZIO; ARD

### Library data of the parts
C? = MCD-00237: Capacitor, MLCC, 100nF, 6V3, X5R, 10%, 0603, T=0,8mm; Manufacturer_Part_Number: CC0603KRX5R5BB104; Manufacturer: YAGEO; Provided_By: SUBCO; ECCN_US: EAR99; ECCN_EU: NEC; Internal_Part_Number: MCD-00237; Status: Released; Part_Type: Capacitor; Package: C0603; ComponentLink1Description: Datasheet; ComponentLink1URL: http://tunmcdsvn.tun.st.com/Component_Datasheet_Library/Trunk/Capacitors/Yageo_Multilayer_capacitor_X5R_series_100pF_to_100uF
CN?#1 = MCD-01037: Socket, 8x2, 2.54mm, VR, TH, Height 8.51mm/10mm, Low insertion force.; Part_Type: Connector; Manufacturer_Part_Number: SSW-108-23-x-D; Manufacturer: SAMTEC; Provided_By: SUBCO; Internal_Part_Number: MCD-01037; Value: Socket 8x2_N144_ARD; Status: Released; ComponentLink1Description: Datasheet; ComponentLink1URL: http://tunmcdsvn.tun.st.com/Component_Datasheet_Library/Trunk/Connectors/Samtec_SSW-SSQ-series; ECCN_US: n/a; ECCN_EU: n/a
CN?#2 = MCD-01039: Socket, 10x2, 2.54mm, VR, TH, Height 8.51mm/10mm, Low insertion force.; Part_Type: Connector; Manufacturer_Part_Number: SSW-110-23-x-D; Manufacturer: SAMTEC; Provided_By: SUBCO; Internal_Part_Number: MCD-01039; Value: Socket 10x2_N144_ARD; Status: Released; ComponentLink1Description: Datasheet; ComponentLink1URL: http://tunmcdsvn.tun.st.com/Component_Datasheet_Library/Trunk/Connectors/Samtec_SSW-SSQ-series; ECCN_US: n/a; ECCN_EU: n/a
CN?#3 CN?#4 = MCD-01210: Header, 35x2, 2,54mm, VR, TH, Height 5.84mm/2.54mm; Part_Type: Connector; Manufacturer_Part_Number: TSW-135-07-x-D; Manufacturer: SAMTEC; Provided_By: SUBCO; Internal_Part_Number: MCD-01210; Value: Header 35x2; Status: Released; ComponentLink1Description: Datasheet; ComponentLink1URL: http://tunmcdsvn.tun.st.com/Component_Datasheet_Library/Trunk/Connectors/Samtec_TSW-HTSW-series; ECCN_US: n/a; ECCN_EU: n/a
CN?#5 = MCD-01040: Socket, 15x2, 2.54mm, VR, TH, Height 8.51mm/10mm, Low insertion force.; Part_Type: Connector; Manufacturer_Part_Number: SSW-115-23-x-D; Manufacturer: SAMTEC; Provided_By: SUBCO; Internal_Part_Number: MCD-01040; Value: Socket 15x2_N144_ARD; Status: Released; ComponentLink1Description: Datasheet; ComponentLink1URL: http://tunmcdsvn.tun.st.com/Component_Datasheet_Library/Trunk/Connectors/Samtec_SSW-SSQ-series; ECCN_US: n/a; ECCN_EU: n/a
CN?#6 = MCD-01041: Socket, 17x2, 2.54mm, VR, TH, Height 8.51mm/10mm, Low insertion force; Part_Type: Connector; Manufacturer_Part_Number: SSW-117-23-x-D; Manufacturer: SAMTEC; Provided_By: SUBCO; Internal_Part_Number: MCD-01041; Value: Socket 17x2_N144_ARD; Status: Released; ComponentLink1Description: Datasheet; ComponentLink1URL: http://tunmcdsvn.tun.st.com/Component_Datasheet_Library/Trunk/Connectors/Samtec_SSW-SSQ-series; ECCN_US: n/a; ECCN_EU: n/a
CN?#7 CN?#8 = MCD-00214: Header, 2x1, 2,54mm, VR, TH, Height 5.84mm/10.16mm; Manufacturer_Part_Number: TSW-102-09-x-S; Manufacturer: SAMTEC; Part_Type: Connector; Value: Header 2x1 16mm; Provided_By: SUBCO; Internal_Part_Number: MCD-00214; ComponentLink1Description: Datasheet; Status: Released; ComponentLink1URL: http://tunmcdsvn.tun.st.com/Component_Datasheet_Library/Trunk/Connectors/Samtec_TSW-HTSW-series; ECCN_US: n/a; ECCN_EU: n/a
HW?#1 HW?#2 = MCD-00043: SHUNT 2.54mm BLACK; Manufacturer: SAMTEC; Part_Type: Mechanical; Alternate_Manufacturer_Part_Number: 316102S111A; Alternate_Manufacturer: JIUBABA; Provided_By: SUBCO; Internal_Part_Number: MCD-00043; Manufacturer_Part_Number: SNT-100-BK-G; ComponentLink1Description: Datasheet; Status: Released; ComponentLink1URL: http://tunmcdsvn.tun.st.com/Component_Datasheet_Library/Trunk/Connectors/Samtec_Shunt_Jumper_SNT100; ECCN_US: n/a; ECCN_EU: n/a
LD?#1 = MCD-00588: LED Green, 0603 SMD, Forward Voltage Typ=2V, Max=2.5V; Part_Type: Display; Manufacturer_Part_Number: LG Q396-PS-35; Manufacturer: OSRAM OPTO SEMICONDUCTORS; Alternate_Manufacturer_Part_Number: VLMTG1300-GS08; Alternate_Manufacturer: VISHAY SEMICONDUCTOR OPTO DIVISION; Provided_By: SUBCO; Internal_Part_Number: MCD-00588; Status: Released; Package: LED 0603; ComponentLink1Description: Datasheet; ComponentLink1URL: http://tunmcdsvn.tun.st.com/Component_Datasheet_Library/Trunk/Display/OSRAM_LED_GREEN_LG Q396-PS-35; Order_Code_Digikey: LG Q396-PS-35-ND; ECCN_US: n/a; ECCN_EU: n/a
LD?#2 = MCD-01061: LED Yellow, 0603 SMD, Forward Voltage min=1.7V, Typ=2V, Max=2.3V; Part_Type: Display; Manufacturer_Part_Number: LY Q396-P1Q2-36; Manufacturer: OSRAM OPTO SEMICONDUCTORS; Provided_By: SUBCO; Internal_Part_Number: MCD-01061; Status: Released; ComponentLink1Description: Datasheet; ComponentLink1URL: http://tunmcdsvn.tun.st.com/Component_Datasheet_Library/Trunk/Display/OSRAM_LED_0603_YELLOW_LY Q396-P1Q2-36; ECCN_US: n/a; ECCN_EU: n/a
LD?#3 = MCD-00586: LED Red, 0603 SMD, Forward Voltage Typ=2V, Max=2.5V; Part_Type: Display; Manufacturer_Part_Number: LS Q976-NR-1; Manufacturer: OSRAM OPTO SEMICONDUCTORS; Alternate_Manufacturer_Part_Number: VLMS1300-GS08; Alternate_Manufacturer: VISHAY SEMICONDUCTOR OPTO DIVISION; Provided_By: SUBCO; Internal_Part_Number: MCD-00586; Status: Released; Package: LED 0603; ComponentLink1Description: Datasheet; ComponentLink1URL: http://tunmcdsvn.tun.st.com/Component_Datasheet_Library/Trunk/Display/OSRAM_LED_RED_LS Q976-NR-1; Order_Code_Digikey: 475-2512-1-ND; ECCN_US: n/a; ECCN_EU: n/a
Q?#1-Q?#3 = MCD-00073: NPN Bipolar Transistor; Part_Type: IC; Manufacturer_Part_Number: BSR14; Manufacturer: ON SEMICONDUCTOR; Alternate_Manufacturer_Part_Number: MMBT2222ALT1G / MMBT2222ALT3G; Provided_By: SUBCO; ECCN_US: EAR99; ECCN_EU: NEC; Revision: *; Internal_Part_Number: MCD-00073; Status: Released; ComponentLink1Description: Datasheet; ComponentLink1URL: http://tunmcdsvn.tun.st.com/Component_Datasheet_Library/Trunk/IC/NXP_Transistor_BSR14; Alternate_Manufacturer: ON SEMICONDUCTOR
R?#1 R?#7 = MCD-00441: Resistor,270R,0402,1%,1/16W; Manufacturer_Part_Number: RC0402FR-07270RL; Manufacturer: YAGEO; Provided_By: SUBCO; ECCN_US: EAR99; ECCN_EU: NEC; Internal_Part_Number: MCD-00441; Status: Released; Part_Type: Resistor; Package: R0402; ComponentLink1Description: Datasheet; ComponentLink1URL: http://tunmcdsvn.tun.st.com/Component_Datasheet_Library/Trunk/Resistors/Yageo_Resistor_RC0402-series
R?#2 = MCD-00178: Resistor,470R,0402,1%,1/16W; Manufacturer_Part_Number: RC0402FR-07470RL; Manufacturer: YAGEO; Provided_By: SUBCO; ECCN_US: EAR99; ECCN_EU: NEC; Internal_Part_Number: MCD-00178; Status: Released; Part_Type: Resistor; Package: R0402; ComponentLink1Description: Datasheet; ComponentLink1URL: http://tunmcdsvn.tun.st.com/Component_Datasheet_Library/Trunk/Resistors/Yageo_Resistor_RC0402-series
R?#3 R?#4 R?#8 = MCD-00222: Resistor,47K,0603,1%,1/10W; Manufacturer_Part_Number: RC0603FR-0747KL; Manufacturer: YAGEO; Provided_By: SUBCO; ECCN_US: EAR99; ECCN_EU: NEC; Internal_Part_Number: MCD-00222; Status: Released; Part_Type: Resistor; ComponentLink1Description: Datasheet; Package: R0603; ComponentLink1URL: http://tunmcdsvn.tun.st.com/Component_Datasheet_Library/Trunk/Resistors/Yageo_Resistor_RC0603-series
R?#5 R?#6 R?#9 = MCD-00223: Resistor,100K,0603,1%,1/10W; Manufacturer_Part_Number: RC0603FR-07100KL; Manufacturer: YAGEO; Provided_By: SUBCO; ECCN_US: EAR99; ECCN_EU: NEC; Internal_Part_Number: MCD-00223; Status: Released; Part_Type: Resistor; ComponentLink1Description: Datasheet; Package: R0603; ComponentLink1URL: http://tunmcdsvn.tun.st.com/Component_Datasheet_Library/Trunk/Resistors/Yageo_Resistor_RC0603-series
SB?#1-SB?#7 SB?#9-SB?#12 SB?#14 SB?#36 SB?#37 = MCD-00071: Solder Bridge ON; Part_Type: Mechanical; Manufacturer_Part_Number: RC0603JR-070RL; Manufacturer: YAGEO; Provided_By: SUBCO; Internal_Part_Number: MCD-00071; Status: Released; ComponentLink1Description: Datasheet; Package: SB0603; ComponentLink1URL: http://tunmcdsvn.tun.st.com/Component_Datasheet_Library/Trunk/Resistors/Yageo_Resistor_RC0603-series; ECCN_US: n/a; ECCN_EU: n/a
SB?#8 SB?#13 SB?#15-SB?#35 = MCD-01618: Solder Bridge 0402 ON; Part_Type: Mechanical; Manufacturer_Part_Number: RC0402JR-070RL; Manufacturer: YAGEO; Provided_By: SUBCO; Internal_Part_Number: MCD-01618; Status: Footprint available; Package: SB0402; ComponentLink1Description: Datasheet; ComponentLink1URL: http://tunmcdsvn.tun.st.com/Component_Datasheet_Library/Trunk/Resistors/Yageo_Resistor_RC0402-series; ECCN_US: n/a; ECCN_EU: n/a

## Sheet tmc4671_eval.SchDoc: {Наименование}
size 420 x 297 mm; DocumentNumber: НРДЦ.ХХХХХХ.ХХХ ХХ; SheetNumber: 4; SheetTotal: 7; PageSetup: Record=PageOptions|CenterHorizontal=False|CenterVertical=False|PrintScale=0.95|XCorrection=0.00|YCorrection=0.00|PrintKind=1|BorderSize=5000000|LeftOffset=0|BottomOffset=0|Orientation=1|PaperLength=1000|PaperWidth=1000|Scale=100|PaperSource=15|PrintQuality=600|MediaType=1|DitherType=10|PaperKind=A4|PrintScaleMode=1; Rule: PcbType=ProtelPcb
Used 2 times, as channels U_tmc4671_eval, U_tmc4671_eval. Parts and nets are listed once, with the designators drawn on the sheet.
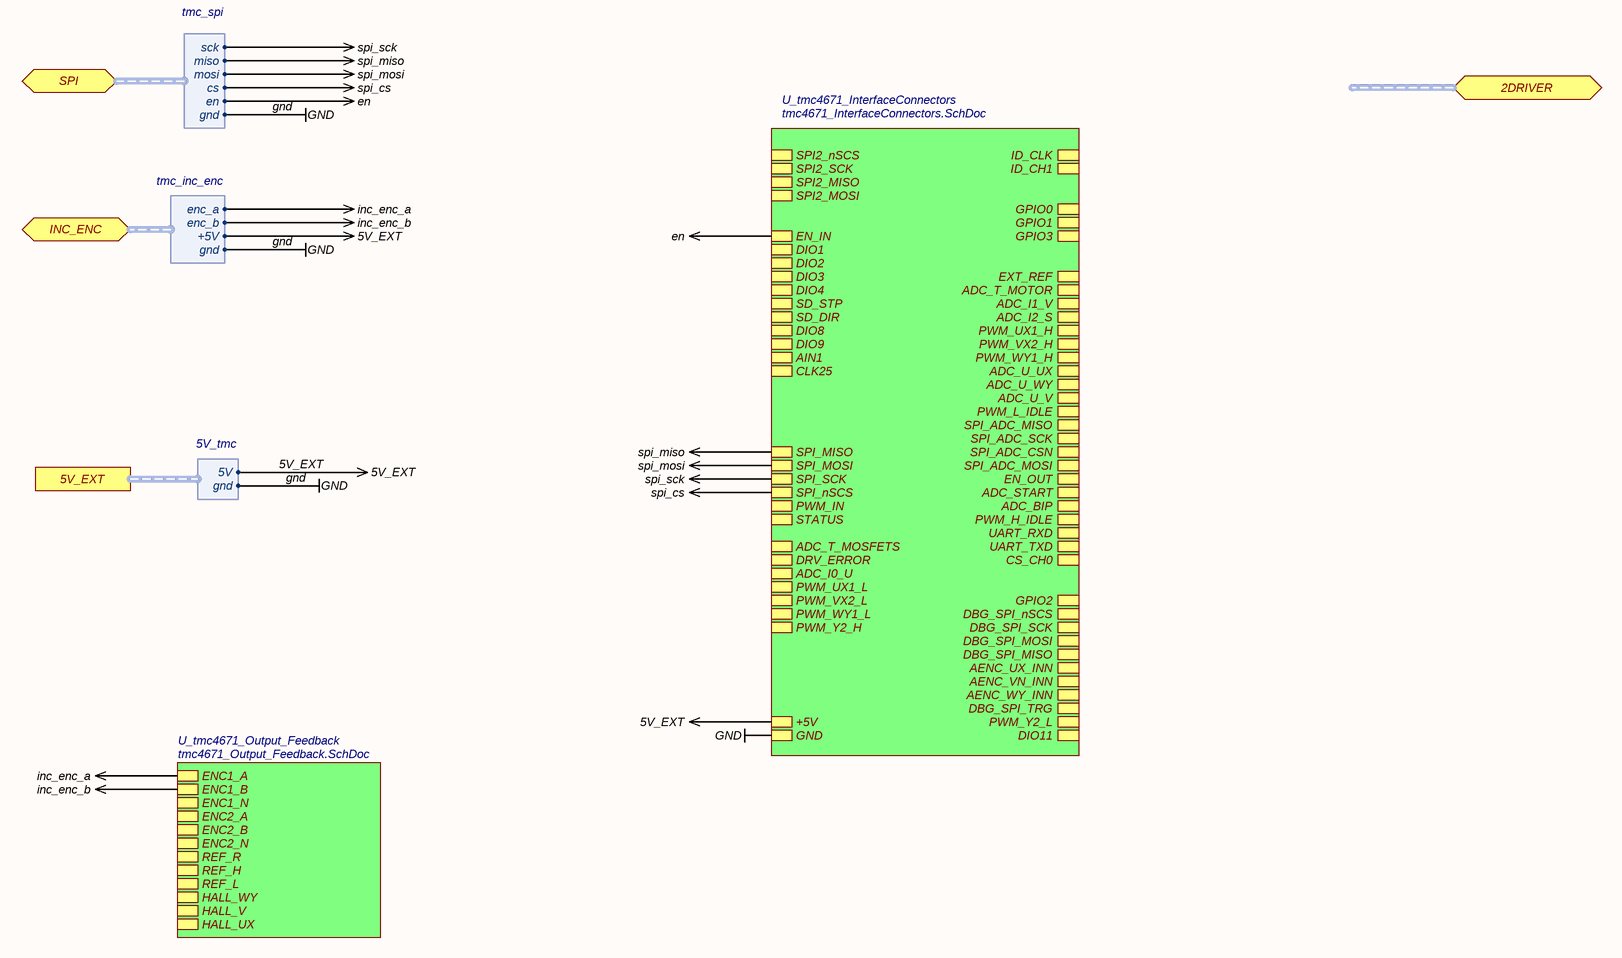
[diagram p3: tmc4671_eval.SchDoc]

### Sub-sheets
U_tmc4671_InterfaceConnectors = tmc4671_InterfaceConnectors.SchDoc: EN_IN, DIO1, DIO2, DIO3, DIO4, SD_STP, SD_DIR, DIO8, DIO9, AIN1, CLK25, GPIO3, SPI_MISO, SPI_MOSI, SPI_SCK, SPI_nSCS, PWM_IN, STATUS, ADC_T_MOSFETS, DRV_ERROR, ADC_I0_U, PWM_UX1_L, PWM_VX2_L, PWM_WY1_L, PWM_Y2_H, EXT_REF, ADC_T_MOTOR, ADC_I1_V, ADC_I2_S, PWM_UX1_H, PWM_VX2_H, PWM_WY1_H, ADC_U_UX, ADC_U_WY, ADC_U_V, PWM_L_IDLE, SPI_ADC_MISO, SPI_ADC_SCK, SPI_ADC_CSN, SPI_ADC_MOSI, EN_OUT, ADC_START, ADC_BIP, PWM_H_IDLE, UART_RXD, UART_TXD, CS_CH0, GPIO2, DBG_SPI_nSCS, DBG_SPI_SCK, DBG_SPI_MOSI, DBG_SPI_MISO, AENC_UX_INN, AENC_VN_INN, AENC_WY_INN, DBG_SPI_TRG, PWM_Y2_L, DIO11, GND, +5V, SPI2_MOSI, ID_CLK, GPIO1, ID_CH1, GPIO0, SPI2_nSCS, SPI2_SCK, SPI2_MISO
U_tmc4671_Output_Feedback = tmc4671_Output_Feedback.SchDoc: ENC1_A, ENC1_B, ENC1_N, ENC2_A, ENC2_B, ENC2_N, REF_R, REF_H, REF_L, HALL_WY, HALL_V, HALL_UX

### Ports
2DRIVER (bidir, harness tmc_spi), 5V_EXT (harness 5V_tmc), INC_ENC (bidir, harness tmc_inc_enc), SPI (bidir, harness tmc_spi)

### Harnesses
5V_tmc: 5V, gnd
tmc_spi: sck, miso, gnd, mosi, en, cs
tmc_inc_enc: enc_a, enc_b, +5V, gnd

### Nets
5V_EXT: sheet U_tmc4671_InterfaceConnectors/+5V, port 5V_EXT.5V, port INC_ENC.+5V
en: sheet U_tmc4671_InterfaceConnectors/EN_IN, port SPI.en
gnd: sheet U_tmc4671_InterfaceConnectors/GND, port 5V_EXT.gnd, port SPI.gnd, port INC_ENC.gnd
inc_enc_a: sheet U_tmc4671_Output_Feedback/ENC1_A, port INC_ENC.enc_a
inc_enc_b: sheet U_tmc4671_Output_Feedback/ENC1_B, port INC_ENC.enc_b
spi_cs: sheet U_tmc4671_InterfaceConnectors/SPI_nSCS, port SPI.cs
spi_miso: sheet U_tmc4671_InterfaceConnectors/SPI_MISO, port SPI.miso
spi_mosi: sheet U_tmc4671_InterfaceConnectors/SPI_MOSI, port SPI.mosi
spi_sck: sheet U_tmc4671_InterfaceConnectors/SPI_SCK, port SPI.sck

### Channels
U_tmc4671_eval: no parts or ports
U_tmc4671_eval: no parts or ports

### Notes on the sheet
- Подп. и дата
- Инв. № дубл.
- Взам. инв. №
- Инв. № подл.
- Лист
- Изм.
- № докум.
- Подп.
- Дата
- Копировал
- Формат А3

## Sheet tmc4671_InterfaceConnectors.SchDoc: Interface connectors, mounting holes & testpads
size A4; DocumentNumber: 1; SheetNumber: 5; SheetTotal: 5
Used 2 times, as channels U_tmc4671_eval/U_tmc4671_InterfaceConnectors, U_tmc4671_eval/U_tmc4671_InterfaceConnectors. Parts and nets are listed once, with the designators drawn on the sheet.
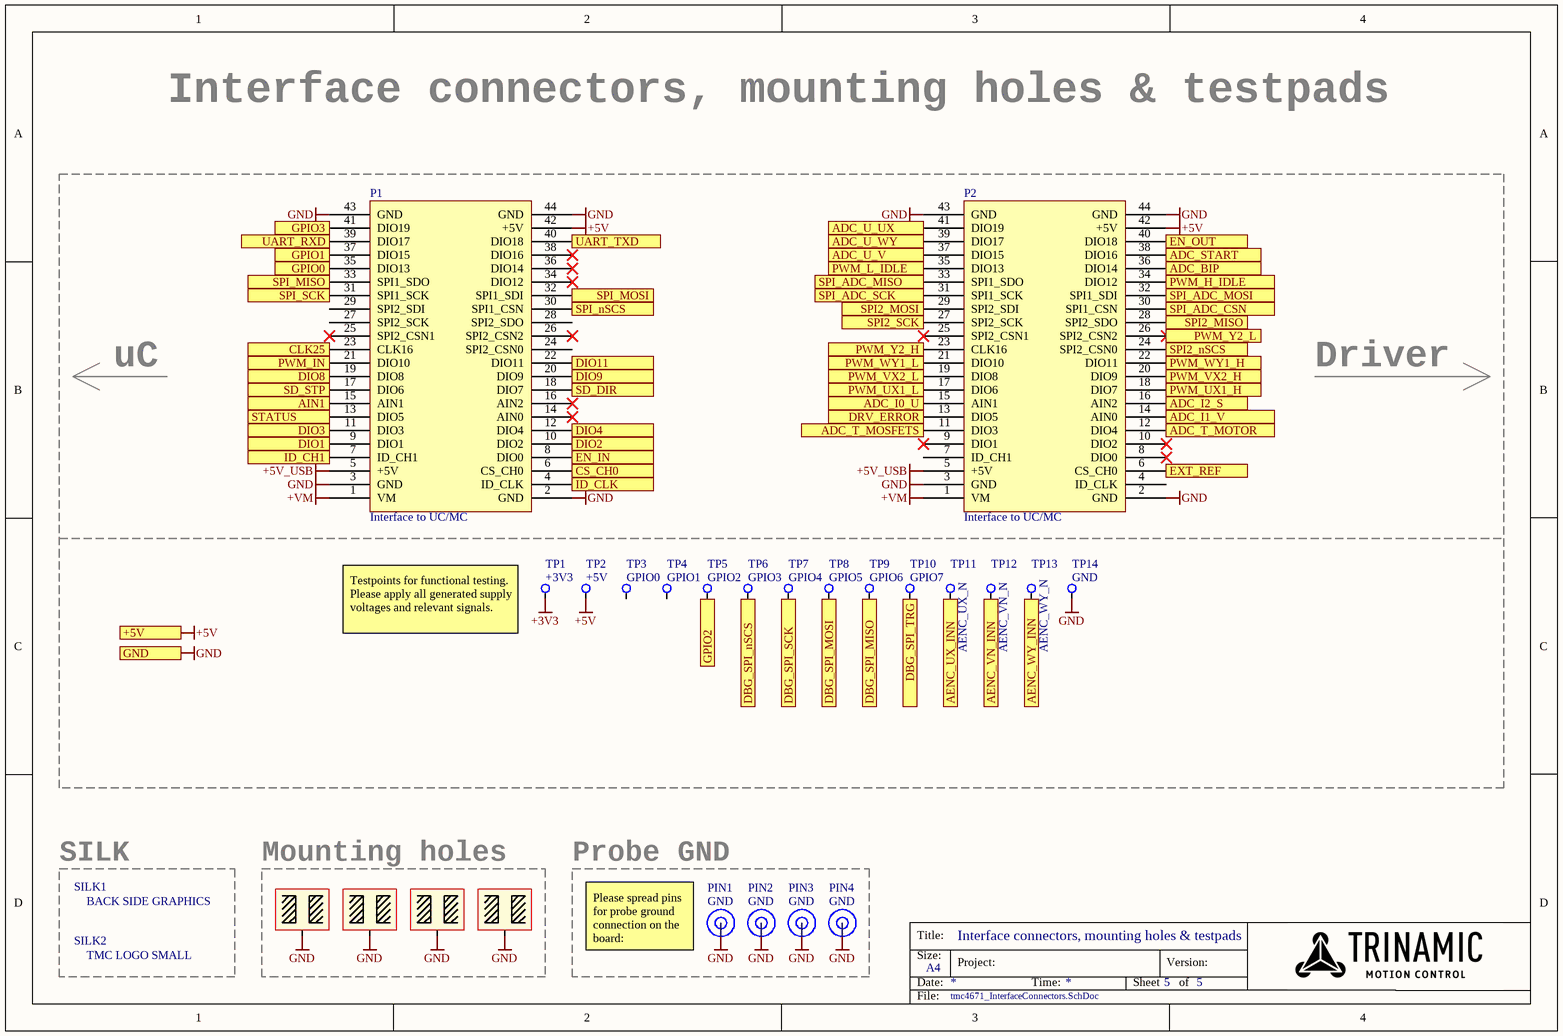
[diagram p4: tmc4671_InterfaceConnectors.SchDoc]

### Parts
MNT1  MOUNTING_HOLE  [MNT_HOLE_6.35-3.2]  (value not drawn)  (no BOM)
MNT2  MOUNTING_HOLE  [MNT_HOLE_6.35-3.2]  (value not drawn)  (no BOM)
MNT3  MOUNTING_HOLE  [MNT_HOLE_6.35-3.2]  (value not drawn)  (no BOM)
MNT4  MOUNTING_HOLE  [MNT_HOLE_6.35-3.2]  (value not drawn)  (no BOM)
P1  Interface to UC/MC  [Interface_Connector]
P2  Interface to UC/MC  [Interface_Connector]
PIN1  GND  [TP_1.1-1.85_OCT]  (no BOM)
PIN2  GND  [TP_1.1-1.85_OCT]  (no BOM)
PIN3  GND  [TP_1.1-1.85_OCT]  (no BOM)
PIN4  GND  [TP_1.1-1.85_OCT]  (no BOM)
SILK1  BACK SIDE GRAPHICS  [TMC4671_EVAL_v1_0_back_label]  (no BOM)
SILK2  TMC LOGO SMALL  [TMC_logo_small]  (no BOM)
TP1  +3V3  [TP_SMD_1.2MM_ROUND]  (no BOM)
TP2  +5V  [TP_SMD_1.2MM_ROUND]  (no BOM)
TP3  GPIO0  [TP_SMD_1.2MM_ROUND]  (no BOM)
TP4  GPIO1  [TP_SMD_1.2MM_ROUND]  (no BOM)
TP5  GPIO2  [TP_SMD_1.2MM_ROUND]  (no BOM)
TP6  GPIO3  [TP_SMD_1.2MM_ROUND]  (no BOM)
TP7  GPIO4  [TP_SMD_1.2MM_ROUND]  (no BOM)
TP8  GPIO5  [TP_SMD_1.2MM_ROUND]  (no BOM)
TP9  GPIO6  [TP_SMD_1.2MM_ROUND]  (no BOM)
TP10  GPIO7  [TP_SMD_1.2MM_ROUND]  (no BOM)
TP11  AENC_UX_N  [TP_SMD_1.2MM_ROUND]  (no BOM)
TP12  AENC_VN_N  [TP_SMD_1.2MM_ROUND]  (no BOM)
TP13  AENC_WY_N  [TP_SMD_1.2MM_ROUND]  (no BOM)
TP14  GND  [TP_SMD_1.2MM_ROUND]  (no BOM)

### Blocks framed on the sheet
SILK: SILK1 SILK2
Mounting holes: MNT1-MNT4
Probe GND: PIN1-PIN4

### Ports
+5V, ADC_BIP, ADC_I0_U, ADC_I1_V, ADC_I2_S, ADC_START, ADC_T_MOSFETS, ADC_T_MOTOR, ADC_U_UX, ADC_U_V, ADC_U_WY, AENC_UX_INN, AENC_VN_INN, AENC_WY_INN, AIN1, CLK25, CS_CH0, DBG_SPI_MISO, DBG_SPI_MOSI, DBG_SPI_nSCS, DBG_SPI_SCK, DBG_SPI_TRG, DIO1, DIO2, DIO3, DIO4, DIO8, DIO9, DIO11, DRV_ERROR, EN_IN, EN_OUT, EXT_REF, GND, GPIO0, GPIO1, GPIO2, GPIO3, ID_CH1, ID_CLK, PWM_H_IDLE, PWM_IN, PWM_L_IDLE, PWM_UX1_H, PWM_UX1_L, PWM_VX2_H, PWM_VX2_L, PWM_WY1_H, PWM_WY1_L, PWM_Y2_H, PWM_Y2_L, SD_DIR, SD_STP, SPI2_MISO, SPI2_MOSI, SPI2_nSCS, SPI2_SCK, SPI_ADC_CSN, SPI_ADC_MISO, SPI_ADC_MOSI, SPI_ADC_SCK, SPI_MISO, SPI_MOSI, SPI_nSCS, SPI_SCK, STATUS, UART_RXD, UART_TXD

### Nets
+3V3: TP1.1
+5V: P1.42(+5V) P2.42(+5V) TP2.1 ; port +5V
+5V_USB: P1.5(+5V) P2.5(+5V)
+VM: P1.1(VM) P2.1(VM)
GND: MNT1.1 MNT2.1 MNT3.1 MNT4.1 P1.2(GND) P1.3(GND) P1.43(GND) P1.44(GND) P2.2(GND) P2.3(GND) P2.43(GND) P2.44(GND) PIN1.1 PIN2.1 PIN3.1 PIN4.1 TP14.1 ; port GND
ADC_BIP: P2.36(DIO14) ; port ADC_BIP
ADC_I0_U: P2.15(AIN1) ; port ADC_I0_U
ADC_I1_V: P2.14(AIN0) ; port ADC_I1_V
ADC_I2_S: P2.16(AIN2) ; port ADC_I2_S
ADC_START: P2.38(DIO16) ; port ADC_START
ADC_T_MOSFETS: P2.11(DIO3) ; port ADC_T_MOSFETS
ADC_T_MOTOR: P2.12(DIO4) ; port ADC_T_MOTOR
ADC_U_UX: P2.41(DIO19) ; port ADC_U_UX
ADC_U_V: P2.37(DIO15) ; port ADC_U_V
ADC_U_WY: P2.39(DIO17) ; port ADC_U_WY
AENC_UX_INN: TP11.1 ; port AENC_UX_INN
AENC_VN_INN: TP12.1 ; port AENC_VN_INN
AENC_WY_INN: TP13.1 ; port AENC_WY_INN
AIN1: P1.15(AIN1) ; port AIN1
CLK25: P1.23(CLK16) ; port CLK25
CS_CH0: P1.6(CS_CH0) ; port CS_CH0
DBG_SPI_MISO: TP9.1 ; port DBG_SPI_MISO
DBG_SPI_MOSI: TP8.1 ; port DBG_SPI_MOSI
DBG_SPI_nSCS: TP6.1 ; port DBG_SPI_nSCS
DBG_SPI_SCK: TP7.1 ; port DBG_SPI_SCK
DBG_SPI_TRG: TP10.1 ; port DBG_SPI_TRG
DIO1: P1.9(DIO1) ; port DIO1
DIO2: P1.10(DIO2) ; port DIO2
DIO3: P1.11(DIO3) ; port DIO3
DIO4: P1.12(DIO4) ; port DIO4
DIO8: P1.19(DIO8) ; port DIO8
DIO9: P1.20(DIO9) ; port DIO9
DIO11: P1.22(DIO11) ; port DIO11
DRV_ERROR: P2.13(DIO5) ; port DRV_ERROR
EN_IN: P1.8(DIO0) ; port EN_IN
EN_OUT: P2.40(DIO18) ; port EN_OUT
EXT_REF: P2.6(CS_CH0) ; port EXT_REF
GPIO0: P1.35(DIO13) ; port GPIO0
GPIO1: P1.37(DIO15) ; port GPIO1
GPIO2: TP5.1 ; port GPIO2
GPIO3: P1.41(DIO19) ; port GPIO3
ID_CH1: P1.7(ID_CH1) ; port ID_CH1
ID_CLK: P1.4(ID_CLK) ; port ID_CLK
PWM_H_IDLE: P2.34(DIO12) ; port PWM_H_IDLE
PWM_IN: P1.21(DIO10) ; port PWM_IN
PWM_L_IDLE: P2.35(DIO13) ; port PWM_L_IDLE
PWM_UX1_H: P2.18(DIO7) ; port PWM_UX1_H
PWM_UX1_L: P2.17(DIO6) ; port PWM_UX1_L
PWM_VX2_H: P2.20(DIO9) ; port PWM_VX2_H
PWM_VX2_L: P2.19(DIO8) ; port PWM_VX2_L
PWM_WY1_H: P2.22(DIO11) ; port PWM_WY1_H
PWM_WY1_L: P2.21(DIO10) ; port PWM_WY1_L
PWM_Y2_H: P2.23(CLK16) ; port PWM_Y2_H
PWM_Y2_L: P2.26(SPI2_CSN2) ; port PWM_Y2_L
SD_DIR: P1.18(DIO7) ; port SD_DIR
SD_STP: P1.17(DIO6) ; port SD_STP
SPI2_MISO: P2.28(SPI2_SDO) ; port SPI2_MISO
SPI2_MOSI: P2.29(SPI2_SDI) ; port SPI2_MOSI
SPI2_nSCS: P2.24(SPI2_CSN0) ; port SPI2_nSCS
SPI2_SCK: P2.27(SPI2_SCK) ; port SPI2_SCK
SPI_ADC_CSN: P2.30(SPI1_CSN) ; port SPI_ADC_CSN
SPI_ADC_MISO: P2.33(SPI1_SDO) ; port SPI_ADC_MISO
SPI_ADC_MOSI: P2.32(SPI1_SDI) ; port SPI_ADC_MOSI
SPI_ADC_SCK: P2.31(SPI1_SCK) ; port SPI_ADC_SCK
SPI_MISO: P1.33(SPI1_SDO) ; port SPI_MISO
SPI_MOSI: P1.32(SPI1_SDI) ; port SPI_MOSI
SPI_nSCS: P1.30(SPI1_CSN) ; port SPI_nSCS
SPI_SCK: P1.31(SPI1_SCK) ; port SPI_SCK
STATUS: P1.13(DIO5) ; port STATUS
UART_RXD: P1.39(DIO17) ; port UART_RXD
UART_TXD: P1.40(DIO18) ; port UART_TXD

Not connected (* = marked no-connect by the designer): P1 14(AIN0)* 16(AIN2)* 24(SPI2_CSN0) 25(SPI2_CSN1)* 26(SPI2_CSN2)* 27(SPI2_SCK) 28(SPI2_SDO) 29(SPI2_SDI) 34(DIO12)* 36(DIO14)* 38(DIO16)*; P2 4(ID_CLK) 7(ID_CH1) 8(DIO0)* 9(DIO1)* 10(DIO2)* 25(SPI2_CSN1)*; TP3 1; TP4 1

### Channels
U_tmc4671_eval/U_tmc4671_InterfaceConnectors: designators end in _U_tmc4671_eval_U_tmc4671_InterfaceConnectors#1; ports +5V=5V_EXT ADC_BIP=NetP2_U_tmc4671_eval_U_tmc4671_InterfaceConnectors#1_36 ADC_I0_U=NetP2_U_tmc4671_eval_U_tmc4671_InterfaceConnectors#1_15 ADC_I1_V=NetP2_U_tmc4671_eval_U_tmc4671_InterfaceConnectors#1_14 ADC_I2_S=NetP2_U_tmc4671_eval_U_tmc4671_InterfaceConnectors#1_16 ADC_START=NetP2_U_tmc4671_eval_U_tmc4671_InterfaceConnectors#1_38 ADC_T_MOSFETS=NetP2_U_tmc4671_eval_U_tmc4671_InterfaceConnectors#1_11 ADC_T_MOTOR=NetP2_U_tmc4671_eval_U_tmc4671_InterfaceConnectors#1_12 ADC_U_UX=NetP2_U_tmc4671_eval_U_tmc4671_InterfaceConnectors#1_41 ADC_U_V=NetP2_U_tmc4671_eval_U_tmc4671_InterfaceConnectors#1_37 ADC_U_WY=NetP2_U_tmc4671_eval_U_tmc4671_InterfaceConnectors#1_39 AENC_UX_INN=NetTP11_U_tmc4671_eval_U_tmc4671_InterfaceConnectors#1_1 AENC_VN_INN=NetTP12_U_tmc4671_eval_U_tmc4671_InterfaceConnectors#1_1 AENC_WY_INN=NetTP13_U_tmc4671_eval_U_tmc4671_InterfaceConnectors#1_1 AIN1=NetP1_U_tmc4671_eval_U_tmc4671_InterfaceConnectors#1_15 CLK25=NetP1_U_tmc4671_eval_U_tmc4671_InterfaceConnectors#1_23 CS_CH0=NetP1_U_tmc4671_eval_U_tmc4671_InterfaceConnectors#1_6 DBG_SPI_MISO=NetTP9_U_tmc4671_eval_U_tmc4671_InterfaceConnectors#1_1 DBG_SPI_MOSI=NetTP8_U_tmc4671_eval_U_tmc4671_InterfaceConnectors#1_1 DBG_SPI_nSCS=NetTP6_U_tmc4671_eval_U_tmc4671_InterfaceConnectors#1_1 DBG_SPI_SCK=NetTP7_U_tmc4671_eval_U_tmc4671_InterfaceConnectors#1_1 DBG_SPI_TRG=NetTP10_U_tmc4671_eval_U_tmc4671_InterfaceConnectors#1_1 DIO1=NetP1_U_tmc4671_eval_U_tmc4671_InterfaceConnectors#1_9 DIO2=NetP1_U_tmc4671_eval_U_tmc4671_InterfaceConnectors#1_10 DIO3=NetP1_U_tmc4671_eval_U_tmc4671_InterfaceConnectors#1_11 DIO4=NetP1_U_tmc4671_eval_U_tmc4671_InterfaceConnectors#1_12 DIO8=NetP1_U_tmc4671_eval_U_tmc4671_InterfaceConnectors#1_19 DIO9=NetP1_U_tmc4671_eval_U_tmc4671_InterfaceConnectors#1_20 DIO11=NetP1_U_tmc4671_eval_U_tmc4671_InterfaceConnectors#1_22 DRV_ERROR=NetP2_U_tmc4671_eval_U_tmc4671_InterfaceConnectors#1_13 EN_IN=spi tmc 2.en EN_OUT=NetP2_U_tmc4671_eval_U_tmc4671_InterfaceConnectors#1_40 EXT_REF=NetP2_U_tmc4671_eval_U_tmc4671_InterfaceConnectors#1_6 GND=ABS ENC AZ.gnd GPIO0=NetP1_U_tmc4671_eval_U_tmc4671_InterfaceConnectors#1_35 GPIO1=NetP1_U_tmc4671_eval_U_tmc4671_InterfaceConnectors#1_37 GPIO2=NetTP5_U_tmc4671_eval_U_tmc4671_InterfaceConnectors#1_1 GPIO3=NetP1_U_tmc4671_eval_U_tmc4671_InterfaceConnectors#1_41 ID_CH1=NetP1_U_tmc4671_eval_U_tmc4671_InterfaceConnectors#1_7 ID_CLK=NetP1_U_tmc4671_eval_U_tmc4671_InterfaceConnectors#1_4 PWM_H_IDLE=NetP2_U_tmc4671_eval_U_tmc4671_InterfaceConnectors#1_34 PWM_IN=NetP1_U_tmc4671_eval_U_tmc4671_InterfaceConnectors#1_21 PWM_L_IDLE=NetP2_U_tmc4671_eval_U_tmc4671_InterfaceConnectors#1_35 PWM_UX1_H=NetP2_U_tmc4671_eval_U_tmc4671_InterfaceConnectors#1_18 PWM_UX1_L=NetP2_U_tmc4671_eval_U_tmc4671_InterfaceConnectors#1_17 PWM_VX2_H=NetP2_U_tmc4671_eval_U_tmc4671_InterfaceConnectors#1_20 PWM_VX2_L=NetP2_U_tmc4671_eval_U_tmc4671_InterfaceConnectors#1_19 PWM_WY1_H=NetP2_U_tmc4671_eval_U_tmc4671_InterfaceConnectors#1_22 PWM_WY1_L=NetP2_U_tmc4671_eval_U_tmc4671_InterfaceConnectors#1_21 PWM_Y2_H=NetP2_U_tmc4671_eval_U_tmc4671_InterfaceConnectors#1_23 PWM_Y2_L=NetP2_U_tmc4671_eval_U_tmc4671_InterfaceConnectors#1_26 SD_DIR=NetP1_U_tmc4671_eval_U_tmc4671_InterfaceConnectors#1_18 SD_STP=NetP1_U_tmc4671_eval_U_tmc4671_InterfaceConnectors#1_17 SPI2_MISO=NetP2_U_tmc4671_eval_U_tmc4671_InterfaceConnectors#1_28 SPI2_MOSI=NetP2_U_tmc4671_eval_U_tmc4671_InterfaceConnectors#1_29 SPI2_nSCS=NetP2_U_tmc4671_eval_U_tmc4671_InterfaceConnectors#1_24 SPI2_SCK=NetP2_U_tmc4671_eval_U_tmc4671_InterfaceConnectors#1_27 SPI_ADC_CSN=NetP2_U_tmc4671_eval_U_tmc4671_InterfaceConnectors#1_30 SPI_ADC_MISO=NetP2_U_tmc4671_eval_U_tmc4671_InterfaceConnectors#1_33 SPI_ADC_MOSI=NetP2_U_tmc4671_eval_U_tmc4671_InterfaceConnectors#1_32 SPI_ADC_SCK=NetP2_U_tmc4671_eval_U_tmc4671_InterfaceConnectors#1_31 SPI_MISO=spi tmc 2.miso SPI_MOSI=spi tmc 2.mosi SPI_nSCS=spi tmc 2.cs SPI_SCK=spi tmc 2.sck STATUS=NetP1_U_tmc4671_eval_U_tmc4671_InterfaceConnectors#1_13 UART_RXD=NetP1_U_tmc4671_eval_U_tmc4671_InterfaceConnectors#1_39 UART_TXD=NetP1_U_tmc4671_eval_U_tmc4671_InterfaceConnectors#1_40
U_tmc4671_eval/U_tmc4671_InterfaceConnectors: designators end in _U_tmc4671_eval_U_tmc4671_InterfaceConnectors#2; ports +5V=5V_EXT ADC_BIP=NetP2_U_tmc4671_eval_U_tmc4671_InterfaceConnectors#2_36 ADC_I0_U=NetP2_U_tmc4671_eval_U_tmc4671_InterfaceConnectors#2_15 ADC_I1_V=NetP2_U_tmc4671_eval_U_tmc4671_InterfaceConnectors#2_14 ADC_I2_S=NetP2_U_tmc4671_eval_U_tmc4671_InterfaceConnectors#2_16 ADC_START=NetP2_U_tmc4671_eval_U_tmc4671_InterfaceConnectors#2_38 ADC_T_MOSFETS=NetP2_U_tmc4671_eval_U_tmc4671_InterfaceConnectors#2_11 ADC_T_MOTOR=NetP2_U_tmc4671_eval_U_tmc4671_InterfaceConnectors#2_12 ADC_U_UX=NetP2_U_tmc4671_eval_U_tmc4671_InterfaceConnectors#2_41 ADC_U_V=NetP2_U_tmc4671_eval_U_tmc4671_InterfaceConnectors#2_37 ADC_U_WY=NetP2_U_tmc4671_eval_U_tmc4671_InterfaceConnectors#2_39 AENC_UX_INN=NetTP11_U_tmc4671_eval_U_tmc4671_InterfaceConnectors#2_1 AENC_VN_INN=NetTP12_U_tmc4671_eval_U_tmc4671_InterfaceConnectors#2_1 AENC_WY_INN=NetTP13_U_tmc4671_eval_U_tmc4671_InterfaceConnectors#2_1 AIN1=NetP1_U_tmc4671_eval_U_tmc4671_InterfaceConnectors#2_15 CLK25=NetP1_U_tmc4671_eval_U_tmc4671_InterfaceConnectors#2_23 CS_CH0=NetP1_U_tmc4671_eval_U_tmc4671_InterfaceConnectors#2_6 DBG_SPI_MISO=NetTP9_U_tmc4671_eval_U_tmc4671_InterfaceConnectors#2_1 DBG_SPI_MOSI=NetTP8_U_tmc4671_eval_U_tmc4671_InterfaceConnectors#2_1 DBG_SPI_nSCS=NetTP6_U_tmc4671_eval_U_tmc4671_InterfaceConnectors#2_1 DBG_SPI_SCK=NetTP7_U_tmc4671_eval_U_tmc4671_InterfaceConnectors#2_1 DBG_SPI_TRG=NetTP10_U_tmc4671_eval_U_tmc4671_InterfaceConnectors#2_1 DIO1=NetP1_U_tmc4671_eval_U_tmc4671_InterfaceConnectors#2_9 DIO2=NetP1_U_tmc4671_eval_U_tmc4671_InterfaceConnectors#2_10 DIO3=NetP1_U_tmc4671_eval_U_tmc4671_InterfaceConnectors#2_11 DIO4=NetP1_U_tmc4671_eval_U_tmc4671_InterfaceConnectors#2_12 DIO8=NetP1_U_tmc4671_eval_U_tmc4671_InterfaceConnectors#2_19 DIO9=NetP1_U_tmc4671_eval_U_tmc4671_InterfaceConnectors#2_20 DIO11=NetP1_U_tmc4671_eval_U_tmc4671_InterfaceConnectors#2_22 DRV_ERROR=NetP2_U_tmc4671_eval_U_tmc4671_InterfaceConnectors#2_13 EN_IN=spi tmc 2.en EN_OUT=NetP2_U_tmc4671_eval_U_tmc4671_InterfaceConnectors#2_40 EXT_REF=NetP2_U_tmc4671_eval_U_tmc4671_InterfaceConnectors#2_6 GND=ABS ENC AZ.gnd GPIO0=NetP1_U_tmc4671_eval_U_tmc4671_InterfaceConnectors#2_35 GPIO1=NetP1_U_tmc4671_eval_U_tmc4671_InterfaceConnectors#2_37 GPIO2=NetTP5_U_tmc4671_eval_U_tmc4671_InterfaceConnectors#2_1 GPIO3=NetP1_U_tmc4671_eval_U_tmc4671_InterfaceConnectors#2_41 ID_CH1=NetP1_U_tmc4671_eval_U_tmc4671_InterfaceConnectors#2_7 ID_CLK=NetP1_U_tmc4671_eval_U_tmc4671_InterfaceConnectors#2_4 PWM_H_IDLE=NetP2_U_tmc4671_eval_U_tmc4671_InterfaceConnectors#2_34 PWM_IN=NetP1_U_tmc4671_eval_U_tmc4671_InterfaceConnectors#2_21 PWM_L_IDLE=NetP2_U_tmc4671_eval_U_tmc4671_InterfaceConnectors#2_35 PWM_UX1_H=NetP2_U_tmc4671_eval_U_tmc4671_InterfaceConnectors#2_18 PWM_UX1_L=NetP2_U_tmc4671_eval_U_tmc4671_InterfaceConnectors#2_17 PWM_VX2_H=NetP2_U_tmc4671_eval_U_tmc4671_InterfaceConnectors#2_20 PWM_VX2_L=NetP2_U_tmc4671_eval_U_tmc4671_InterfaceConnectors#2_19 PWM_WY1_H=NetP2_U_tmc4671_eval_U_tmc4671_InterfaceConnectors#2_22 PWM_WY1_L=NetP2_U_tmc4671_eval_U_tmc4671_InterfaceConnectors#2_21 PWM_Y2_H=NetP2_U_tmc4671_eval_U_tmc4671_InterfaceConnectors#2_23 PWM_Y2_L=NetP2_U_tmc4671_eval_U_tmc4671_InterfaceConnectors#2_26 SD_DIR=NetP1_U_tmc4671_eval_U_tmc4671_InterfaceConnectors#2_18 SD_STP=NetP1_U_tmc4671_eval_U_tmc4671_InterfaceConnectors#2_17 SPI2_MISO=NetP2_U_tmc4671_eval_U_tmc4671_InterfaceConnectors#2_28 SPI2_MOSI=NetP2_U_tmc4671_eval_U_tmc4671_InterfaceConnectors#2_29 SPI2_nSCS=NetP2_U_tmc4671_eval_U_tmc4671_InterfaceConnectors#2_24 SPI2_SCK=NetP2_U_tmc4671_eval_U_tmc4671_InterfaceConnectors#2_27 SPI_ADC_CSN=NetP2_U_tmc4671_eval_U_tmc4671_InterfaceConnectors#2_30 SPI_ADC_MISO=NetP2_U_tmc4671_eval_U_tmc4671_InterfaceConnectors#2_33 SPI_ADC_MOSI=NetP2_U_tmc4671_eval_U_tmc4671_InterfaceConnectors#2_32 SPI_ADC_SCK=NetP2_U_tmc4671_eval_U_tmc4671_InterfaceConnectors#2_31 SPI_MISO=spi tmc 2.miso SPI_MOSI=spi tmc 2.mosi SPI_nSCS=spi tmc 2.cs SPI_SCK=spi tmc 2.sck STATUS=NetP1_U_tmc4671_eval_U_tmc4671_InterfaceConnectors#2_13 UART_RXD=NetP1_U_tmc4671_eval_U_tmc4671_InterfaceConnectors#2_39 UART_TXD=NetP1_U_tmc4671_eval_U_tmc4671_InterfaceConnectors#2_40

### Notes on the sheet
- uC
- Driver
- (near TP1) Testpoints for functional testing.
  Please apply all generated supply voltages and relevant signals.
- (near PIN1) Please spread pins for probe ground connection on the board:
- Title:
- Size:
- Date:
- A4
- Project:
- Time:
- Sheet
- Version:
- of
- File:

### Library data of the parts
P1 P2 = Interface Connector, 44 Pins: Board-To-Board Connector, 2.54 mm, 44 Contacts, Receptacle, HLE Series, Surface Mount, 2 Rows; MPN: HLE-122-02-L-DV; MF: SAMTEC
PIN1-PIN4 = TP_1.1-1.85_OCT: TH testpoint, 1.1 hole, 1.85 pad, octagonal
SILK1 SILK2 = SILK_GFX
TP1-TP14 = TP_SMD_Xmm: SMD testpoint, 1.2mm pad, round